# EasyEDA Pro project 2024-SS-ZT-1(最后一练).eprj

# Schematic SCH

## Sheets
1 P1: Create Date: 2024-05-29; Page Name: P1; Project Name: 2024-SS-ZT-1(最后一练); Schematic Name: SCH; Update Date: 2024-05-29; Company: EDA设计与开发; Page Size: A4; Version: V1.0
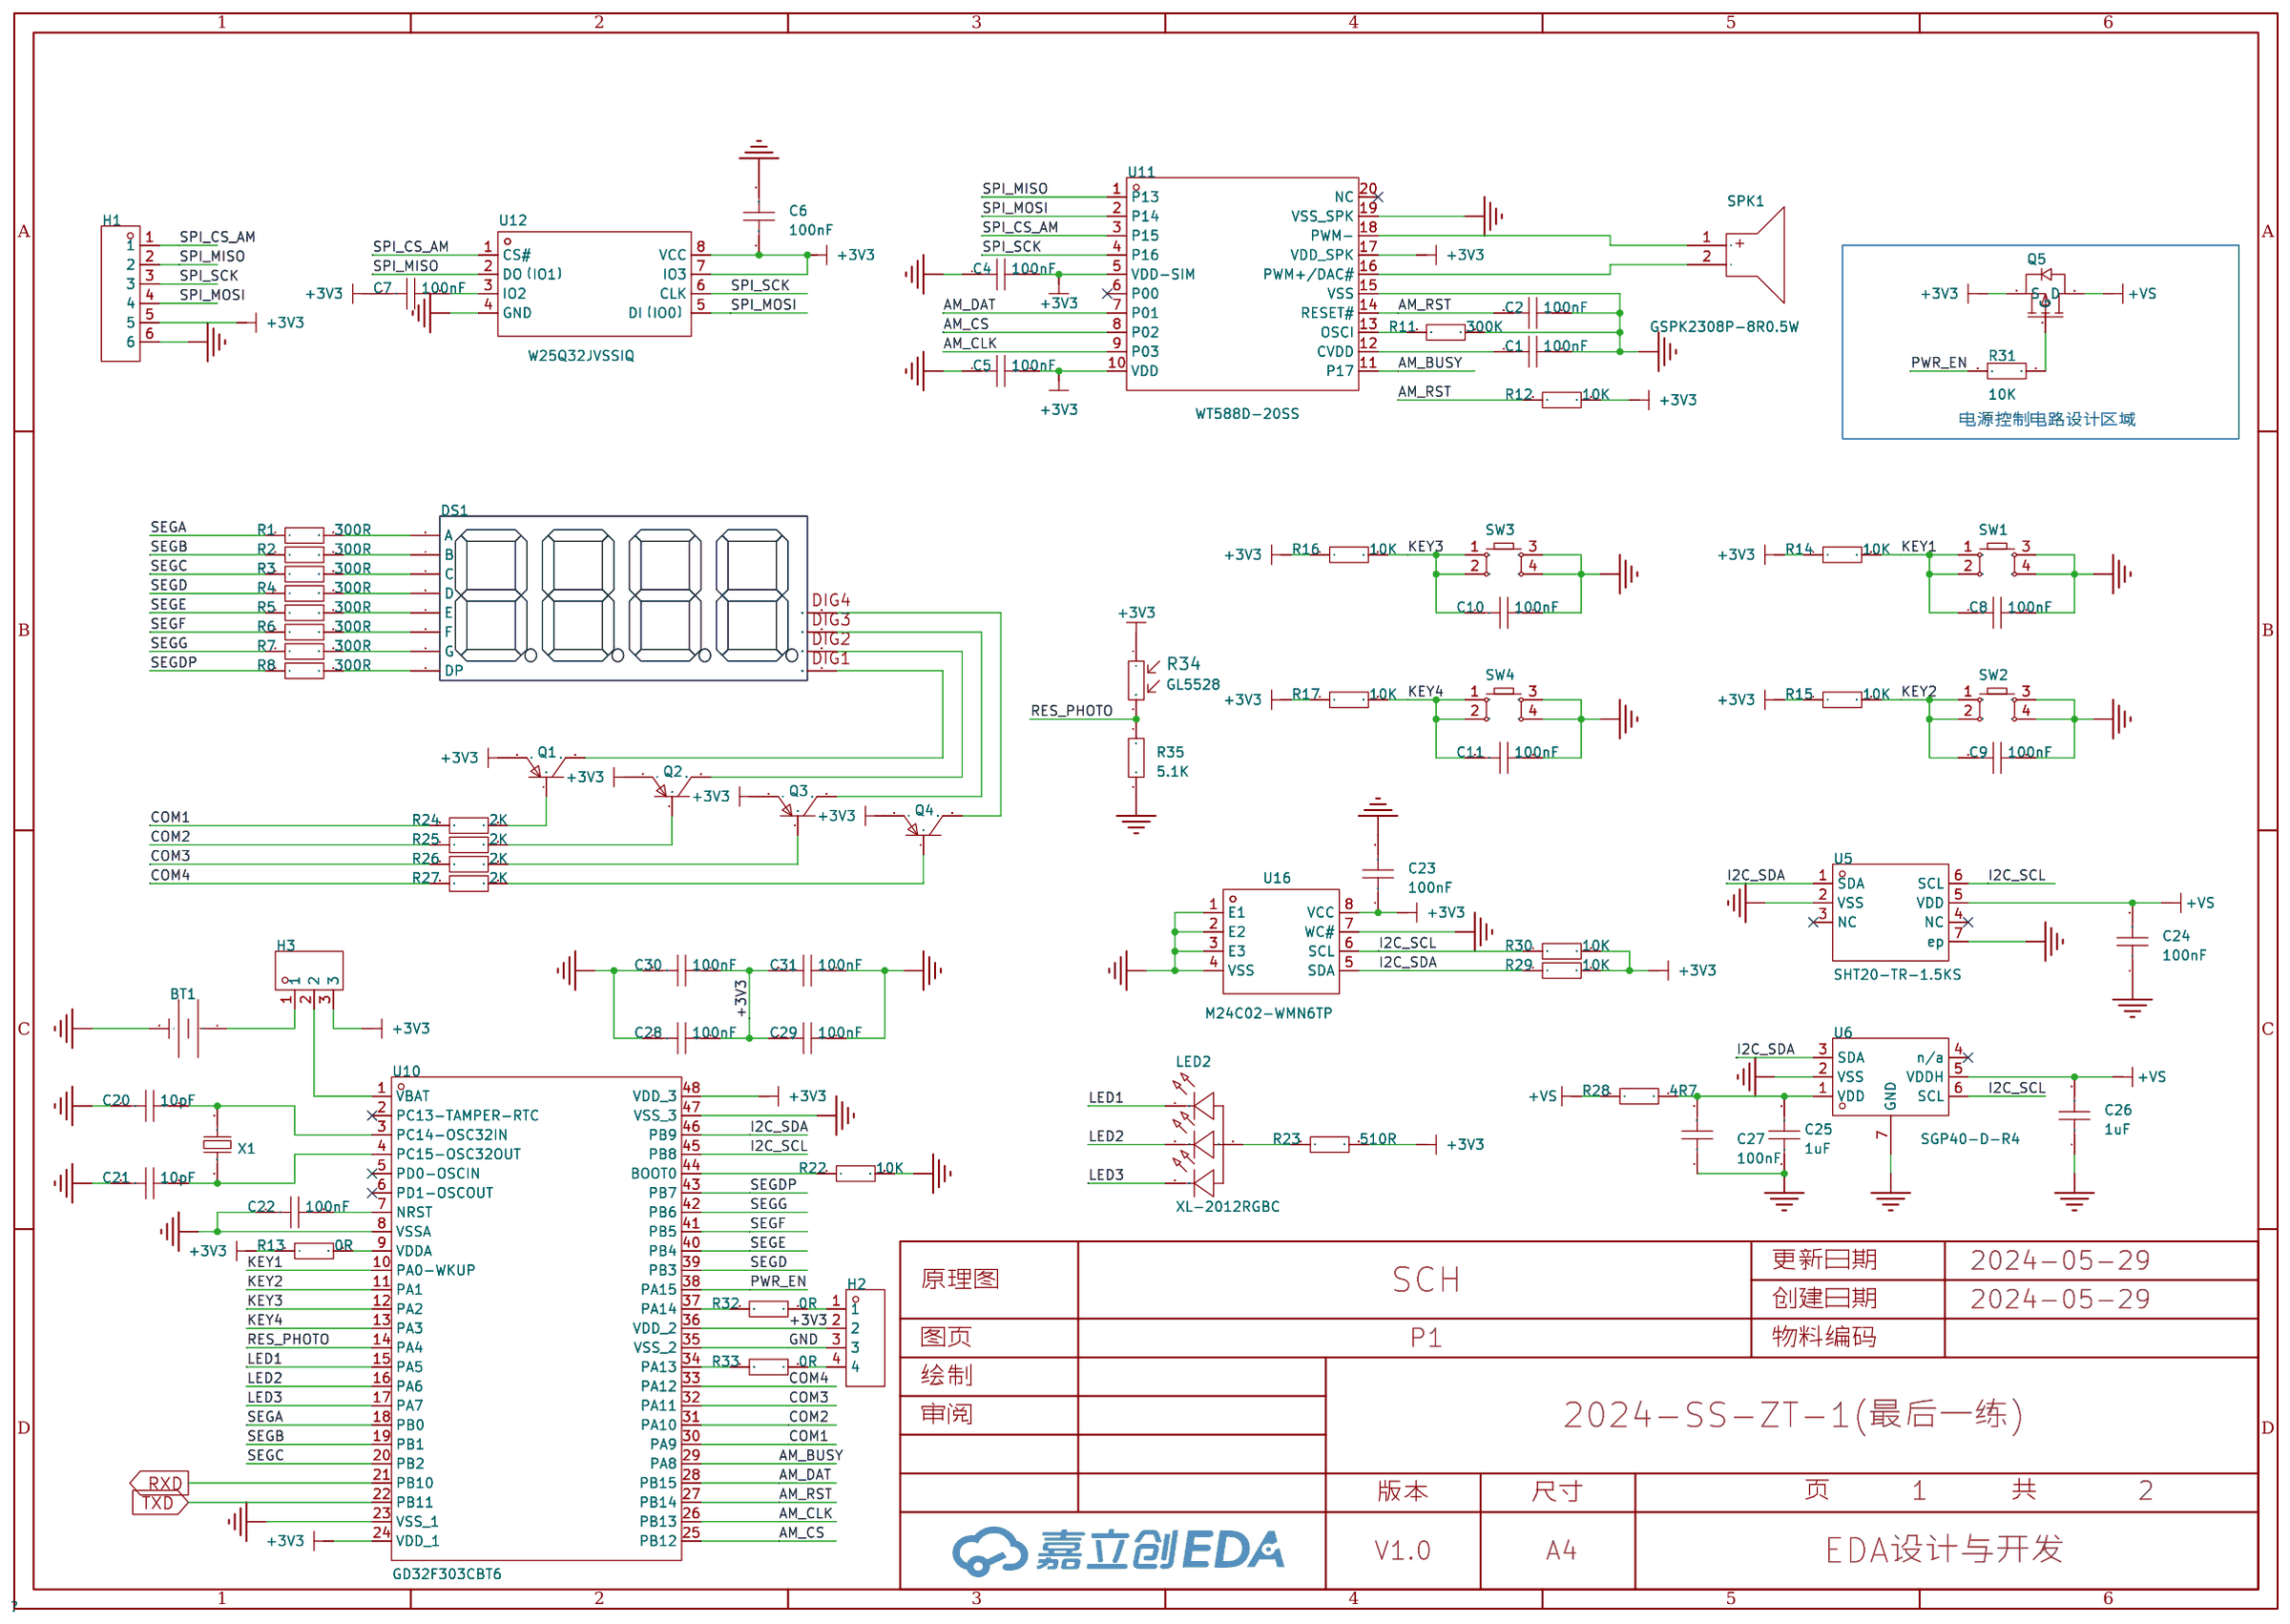
[diagram p0: P1]
2 P2: Page Name: P2; Company: 嘉立创EDA
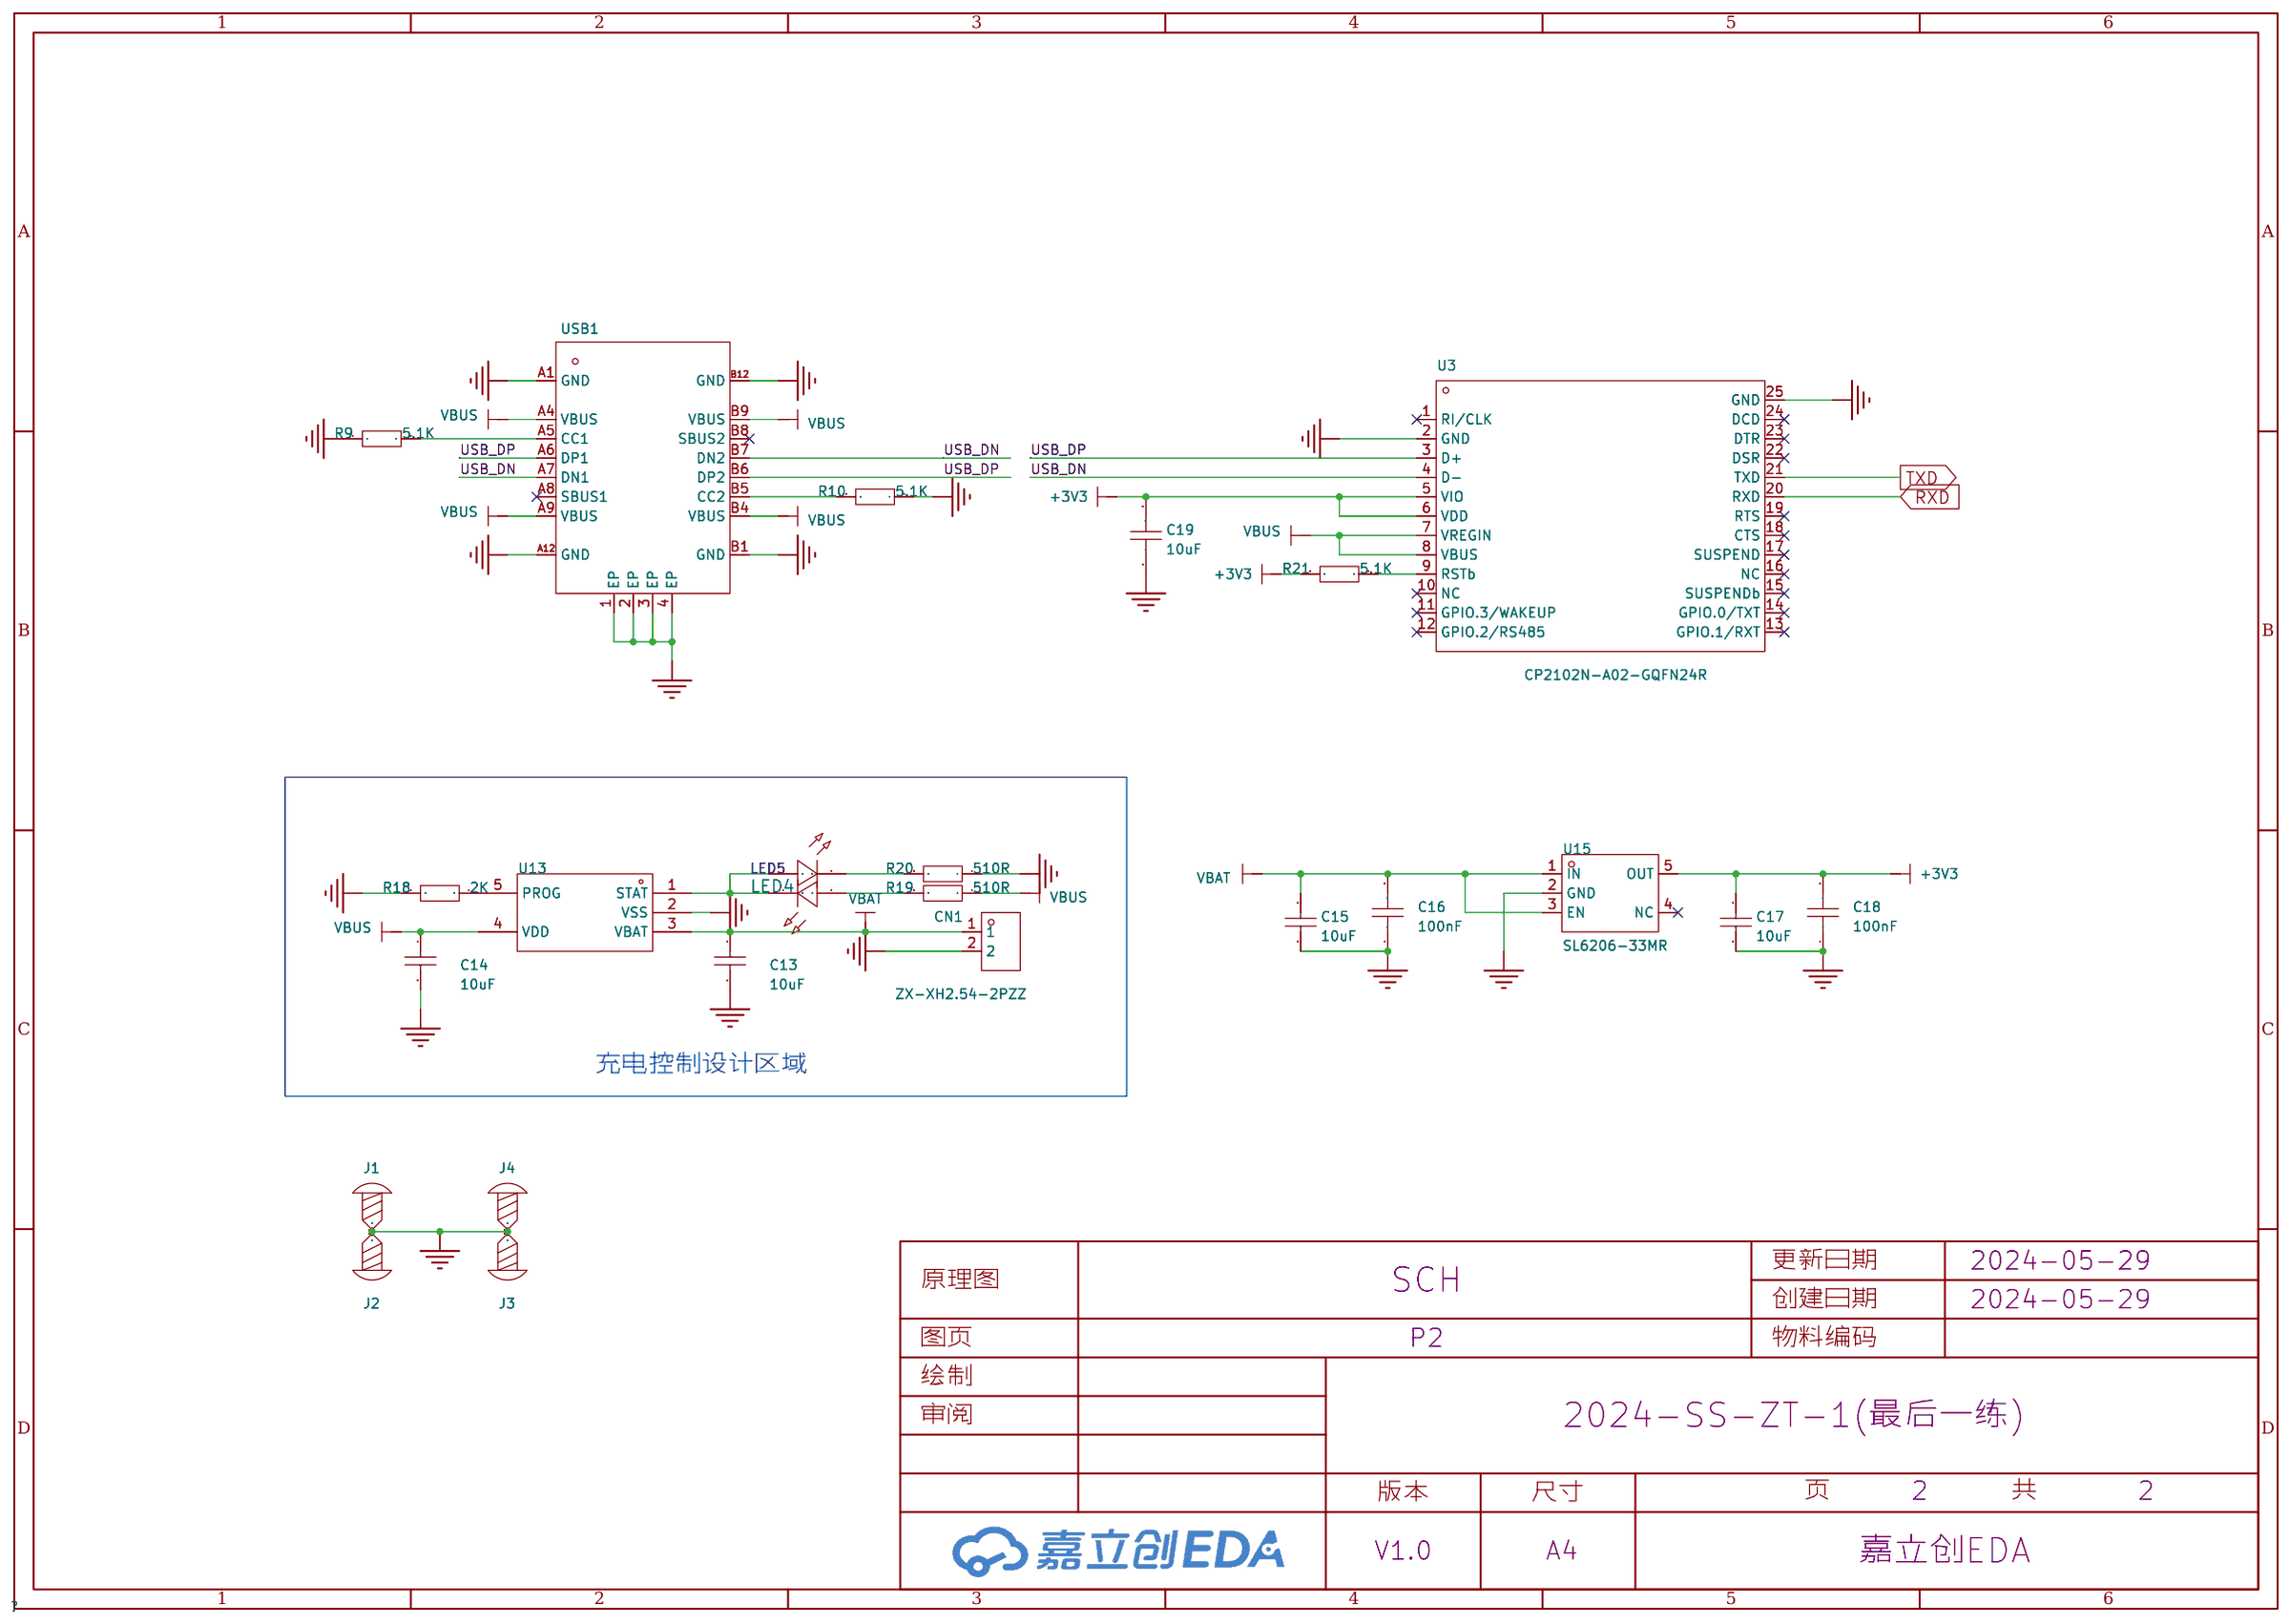
[diagram p1: P2]

## Parts
sheet P1
BT1  BS-12-B3AA003  [BAT-SMD_BS-12-B3AA011]
C1  100nF  [C0805]
C2  100nF  [C0805]
C4  100nF  [C0805]
C5  100nF  [C0805]
C6  100nF  [C0805]
C7  100nF  [C0805]
C8  100nF  [C0805]
C9  100nF  [C0805]
C10  100nF  [C0805]
C11  100nF  [C0805]
C20  10pF  [C0805]
C21  10pF  [C0805]
C22  100nF  [C0805]
C23  100nF  [C0805]
C24  100nF  [C0805]
C25  1uF  [C0805]
C26  1uF  [C0805]
C27  100nF  [C0805]
C28  100nF  [C0805]
C29  100nF  [C0805]
C30  100nF  [C0805]
C31  100nF  [C0805]
DS1  -  [LED-SEG-TH_FJ5461AH]
H1  -  [HDR-TH_6P-P2.54-V-F]
H2  -  [HDR-TH_4P-P2.54-V-F]
H3  Jumper3  [HDR-TH_3P-P2.54-V-M-A]
LED2  XL-2012RGBC  [LED-SMD_4P-L2.0-W1.3-BR]
Q1  -  [S8550P_SOT]
Q2  -  [S8550P_SOT]
Q3  -  [S8550P_SOT]
Q4  -  [S8550P_SOT]
Q5  -  [AO3401A_SOT-23-3]
R1  300R  [R0805]
R2  300R  [R0805]
R3  300R  [R0805]
R4  300R  [R0805]
R5  300R  [R0805]
R6  300R  [R0805]
R7  300R  [R0805]
R8  300R  [R0805]
R11  300K  [R0805]
R12  10K  [R0805]
R13  0R  [R0805]
R14  10K  [R0805]
R15  10K  [R0805]
R16  10K  [R0805]
R17  10K  [R0805]
R22  10K  [R0805]
R23  510R  [R0805]
R24  2K  [R0805]
R25  2K  [R0805]
R26  2K  [R0805]
R27  2K  [R0805]
R28  4R7  [R0805]
R29  10K  [R0805]
R30  10K  [R0805]
R31  10K  [R0805]
R32  0R  [R0805]
R33  0R  [R0805]
R34  GL5528  [RES-TH_L5.1-W4.3-P3.40-D0.5]
R35  5.1K  [R0805]
SPK1  GSPK2308P-8R0.5W  [SPK-TH_BD23.0-P10.00-D0.8-L-RD]
SW1  -  [Key_SMD_12x12x7.3]
SW2  -  [Key_SMD_12x12x7.3]
SW3  -  [Key_SMD_12x12x7.3]
SW4  -  [Key_SMD_12x12x7.3]
U5  SHT20-TR-1.5KS  [DFN-6_L3.0-W3.0-P0.95-TR-EP]
U6  SGP40-D-R4  [DFN-6_L2.4-W2.4-P0.80-TL-EP]
U10  GD32F303CBT6  [LQFP-48_L7.0-W7.0-P0.50-LS9.0-BL]
U11  WT588D-20SS  [SSOP-20_L7.2-W5.3-P0.65-LS7.8-BL]
U12  W25Q32JVSSIQ  [SOIC-8_L5.3-W5.3-P1.27-LS8.0-BL]
U16  M24C02-WMN6TP  [SOIC-8_L4.9-W3.9-P1.27-LS6.0-BL]
X1  32.768kHz  [FC-135R_L3.2-W1.5]
sheet P2
C13  10uF  [C1206]
C14  10uF  [C1206]
C15  10uF  [C1206]
C16  100nF  [C0805]
C17  10uF  [C1206]
C18  100nF  [C0805]
C19  10uF  [C0805]
CN1  ZX-XH2.54-2PZZ  [CONN-TH_2P-P2.50_HX25003-2A]
J1  -  [M2螺丝]
J2  -  [M2螺丝]
J3  -  [M2螺丝]
J4  -  [M2螺丝]
LED4  -  [LED_0805]
LED5  -  [LED_0805]
R9  5.1K  [R0805]
R10  5.1K  [R0805]
R18  2K  [R0805]
R19  510R  [R0805]
R20  510R  [R0805]
R21  5.1K  [R0805]
U3  CP2102N-A02-GQFN24R  [QFN-24_L4.0-W4.0-P0.50-TL-EP2.6]
U13  -  [SOP_BCON]
U15  SL6206-33MR  [SOT-23-5_L2.9-W1.6-P0.95-LS2.8-BL]
USB1  -  [USB_TYPE-C-16P]

## Library data of the parts
BT1 = BS-12-B3AA003: 连接器类型:电池底座;适用电池规格:CR1220;工作温度范围:-25℃~+85℃;; Supplier Part: C964723; Manufacturer: MYOUNG(美阳); Supplier Footprint: SMD; JLCPCB Part Class: 扩展库; Datasheet: https://atta.szlcsc.com/upload/public/pdf/source/20201218/C964723_733B638E287393F86295A2A4DAE43C75.pdf; Supplier: LCSC; Connector Type: 电池底座; Battery Type: CR1220; Operating Temperature Range: -25℃~+85℃
C1 C2 C4-C11 C16 C18-C31 = CAP_0805: Supplier Footprint: 0805
DS1 = LED_SEG_TH_0.56x4: Supplier Footprint: 插件
H1 = HDR-F_2.54_1x6P: Supplier Part: C40877; Supplier Footprint: 插件
H2 = HDR-F_2.54_1x4P: Supplier Part: C2718488; Supplier Footprint: 插件
H3 = Jumper3: Supplier Part: C2940050; Supplier Footprint: HDR-TH-3P-2.54mm; JLCPCB Part Class: 扩展库; Supplier: LCSC
LED2 = XL-2012RGBC: 发光颜色:RGB三色;功率:80mW；80mW；55mW;正向电流:25mA;主波长:619nm~624nm；463nm~466nm；524nm~527nm;二极管配置:-;透镜颜色:无色透明透镜;色温:-;发光角度:120°;载带方式:正贴;工作温度:-30℃~+85℃;; Supplier Part: C965848; Manufacturer: XINGLIGHT(成兴光); Supplier Footprint: 0805; JLCPCB Part Class: 扩展库; Datasheet: https://atta.szlcsc.com/upload/public/pdf/source/20221102/35E310354F68AE1BCFC07B93F5E395D6.pdf; Supplier: LCSC; Emitted Color: RGB三色; Power Dissipation: 80mW；80mW；55mW; Forward Current: 25mA; Dominant Wavelength: 619nm~624nm；463nm~466nm；524nm~527nm; Peak Wavelength: 624nm；528nm；469nm; Lens Color: 无色透明透镜; Viewing Angle: 120°; Mounting Sytle: 正贴; Operating Temperature: -30℃~+85℃
Q1-Q4 = S8550_SOT_PNP: Supplier Footprint: SOT-23
Q5 = AO3401A_P: Supplier Footprint: SOT-23-3L; Supplier Part: C15127
R1-R33 R35 = Res_0805: Supplier Footprint: 0805
R34 = GL5528: 暗电阻:1MΩ;亮电阻 @ 10Lux:8kΩ~20kΩ;光谱峰值(波长):540nm;; LCSC Part Name: 亮电阻:8kΩ~20kΩ 暗电阻:1MΩ; Supplier Part: C125627; Manufacturer: 森霸; Supplier Footprint: 插件,P=3mm; JLCPCB Part Class: 扩展库; Datasheet: https://atta.szlcsc.com/upload/public/pdf/source/20230427/842A99E3D53A83729D7968886D4EFCBB.pdf; Supplier: LCSC; Dark Resistance: 1MΩ; Illuminated Resistance @ 10Lux: 8kΩ~20kΩ; Applied Voltage: 150V; Spectral Peak: 540nm
SPK1 = GSPK2308P-8R0.5W: Supplier Part: C530532; Manufacturer: INGHAi(赢海); JLCPCB Part Class: 扩展库; Datasheet: https://atta.szlcsc.com/upload/public/pdf/source/20200723/C530532_3DB1F973601B36F20FBCCA52751811A3.pdf; Supplier: LCSC
SW1-SW4 = Key_SMD_12x12x7.3: Supplier Footprint: SMD
U5 = SHT20-TR-1.5KS: 接口类型:I2C;; LCSC Part Name: 1-100706-01; Supplier Part: C53865; Manufacturer: Sensirion(瑞士盛思锐); Supplier Footprint: DFN-6-EP(3x3); JLCPCB Part Class: 扩展库; Datasheet: https://atta.szlcsc.com/upload/public/pdf/source/20151012/1457707445424.pdf; Supplier: LCSC; Interface Type: I2C; Supply Voltage: 2.1V~3.6V
U6 = SGP40-D-R4: 气体类型:空气质量;精度:-;; LCSC Part Name: 3.000.384; Supplier Part: C2874215; Manufacturer: Sensirion(瑞士盛思锐); Supplier Footprint: DFN-6-EP(2.4x2.4); JLCPCB Part Class: 扩展库; Datasheet: https://atta.szlcsc.com/upload/public/pdf/source/20231011/67A6038984BE66B07B1FF2325C50691F.pdf; Supplier: LCSC; Type: 空气质量; Operating Temperature: -10℃~+50℃
U10 = GD32F303CBT6_C3013779: CPU内核:CM4;程序存储容量:128KB;RAM总容量:32KB;GPIO端口数量:37;工作电压范围:-;CPU最大主频:120MHz;程序存储器类型:FLASH;; Supplier Part: C3013779; Manufacturer: GigaDevice(兆易创新); Supplier Footprint: LQFP-48(7x7); JLCPCB Part Class: 扩展库; Datasheet: https://atta.szlcsc.com/upload/public/pdf/source/20220624/E1A57ED816B162D6D1424864911A792F.pdf; Supplier: LCSC; CPU Core: CM4; Program Storage Size: 128KB; RAM Size: 32KB; GPIO Ports Number: 37; CPU Maximum Speed: 120MHz; Program Memory Type: FLASH; ADC (Bit): 12bit; DAC (Bit): 12bit; 16Bit Timer: 7; CAN: 1; UART/USART: 3; I2C: 2; I2S: 2; SPI: 3; Peripheral/Function: 看门狗；RTC实时时钟; Watchdog: 有; Real-Time Clock: 有
U11 = WT588D-20SS: 高品质语音芯片; Supplier Part: C87498; Manufacturer: WT(唯创知音); Supplier Footprint: SSOP-20-208mil; JLCPCB Part Class: 扩展库; Datasheet: https://atta.szlcsc.com/upload/public/pdf/source/20161217/1481939141189.pdf; Supplier: LCSC
U12 = W25Q32JVSSIQ_C82344: 接口类型:SPI;存储容量:32Mbit;; Supplier Part: C82344; Manufacturer: WINBOND(华邦); Supplier Footprint: SOIC-8-208mil; JLCPCB Part Class: 扩展库; Datasheet: https://atta.szlcsc.com/upload/public/pdf/source/20160910/1473490310454.pdf; Supplier: LCSC; Interface Type: SPI; Memory Size: 32Mbit; Supply Voltage: 2.7V~3.6V; Page Programming Time (Tpp): 3ms; Operating Temperature: -40℃~+85℃
U16 = M24C02-WMN6TP: 接口类型:I2C;存储容量:2Kbit;; Supplier Part: C7562; Manufacturer: ST(意法半导体); Supplier Footprint: SOIC-8; JLCPCB Part Class: Extended Part; Datasheet: https://atta.szlcsc.com/upload/public/pdf/source/20140724/1457707167301.pdf; Supplier: LCSC; Interface Type: I2C; Memory Size: 2Kbit; Supply Voltage: 2.5V~5.5V; Operating Temperature: -40℃~+85℃
X1 = Q13FC13500004_C32346: 晶振类型:贴片晶振;频率:32.768kHz;常温频差:±20ppm;外接负载电容:12.5pF;; LCSC Part Name: 32.768kHz ±20ppm 12.5pF; Supplier Part: C32346; Manufacturer: EPSON(爱普生); Manufacturer Part: Q13FC13500004; Supplier Footprint: SMD3215-2P; JLCPCB Part Class: 基础库; Datasheet: https://atta.szlcsc.com/upload/public/pdf/source/20190108/C32346_746D6B07EAF90824457A96480007685F.pdf; Supplier: LCSC; Crystal Type: 贴片晶振; Normal temperature Frequency Tolerance: ±20ppm; External load capacitor: 12.5pF; Equivalent Series Resistance (ESR): 70kΩ; Operating Temperature: -40℃~+85℃
C13-C15 C17 = CL31A106KBHNNNE: 容值:10uF;精度:±10%;额定电压:50V;材质(温度系数):X5R;; LCSC Part Name: 10uF ±10% 50V; Supplier Part: C13585; Manufacturer: SAMSUNG(三星); Supplier Footprint: 1206; JLCPCB Part Class: 基础库; Datasheet: https://atta.szlcsc.com/upload/public/pdf/source/20160218/1457707763339.pdf; Supplier: LCSC; Tolerance: ±10%; Voltage Rated: 50V; Temperature Coefficient: X5R
CN1 = ZX-XH2.54-2PZZ: 插针结构:1x2P;间距:2.54mm;安装方式:直插;参考系列:XH;总PIN数:2P;排数:1;每排PIN数:2;行距:-;额定电流:3A;触头材质:黄铜;触头镀层:锡;工作温度范围:-25℃~+85℃;; Supplier Part: C7429632; Manufacturer: Megastar(兆星); Supplier Footprint: 插件,P=2.54mm; JLCPCB Part Class: 扩展库; Datasheet: https://atta.szlcsc.com/upload/public/pdf/source/20230619/19BA6947230AA44A04D3EDD65E618FD0.pdf; Supplier: LCSC; Pins Structure: 1x2P; Pitch: 2.54mm; Mounting Style: 直插; Reference Series: XH; Number of Pins: 2P; Number of Rows: 1; Number of PINs Per Row: 2; Current Rating (Max): 3A; Contact Material: 黄铜; Contact Plating: 锡; Operating Temperature Range: -25℃~+85℃
J1-J4 = M2螺丝: Supplier Footprint: 插件
LED4 = LED_0805-R: Supplier Footprint: 0805
LED5 = LED_0805-G: Supplier Footprint: 0805
U3 = CP2102N-A02-GQFN24R: 应用功能:USB转UART;接口协议:UART;; Supplier Part: C969151; Manufacturer: SKYWORKS/SILICON LABS(芯科); Supplier Footprint: QFN-24-EP(4x4); JLCPCB Part Class: 扩展库; Datasheet: https://atta.szlcsc.com/upload/public/pdf/source/20201204/C964632_F2B790CC23A72455AEF523510305B30A.pdf; Supplier: LCSC; Applications Function: USB转UART; Protocol: UART; Supply Voltage: 3V~3.6V; Operating Temperature: -40℃~+85℃@(Ta)
U13 = BCON
U15 = SL6206-33MR: 输出类型:-;; Supplier Part: C707122; Manufacturer: Slkor(萨科微); Supplier Footprint: SOT-23-5; JLCPCB Part Class: 扩展库; Datasheet: https://atta.szlcsc.com/upload/public/pdf/source/20200721/C707121_33633D17E61D5DC97F22208BE63A0FB1.pdf; Supplier: LCSC
USB1 = USB_TYPE-C-16P: Supplier Footprint: SMD

## Nets
+3V3: C4.2 C5.2 C6.2 C7.1 C17.2 C18.2 C19.2 C23.1 C28.1 C29.2 C30.1 C31.2 H1.5 H2.2 H3.3 Q1.2(E) Q2.2(E) Q3.2(E) Q4.2(E) Q5.2(S) R12.2 R13.1 R14.1 R15.1 R16.1 R17.1 R21.2 R23.2 R29.2 R30.2 R34.1 U3.5(VIO) U3.6(VDD) U10.24(VDD_1) U10.36(VDD_2) U10.48(VDD_3) U11.5(VDD-SIM) U11.10(VDD) U11.17(VDD_SPK) U12.7(IO3) U12.8(VCC) U15.5(OUT) U16.8(VCC)
GND: BT1.2(-) C1.2 C2.2 C4.1 C5.1 C6.1 C8.2 C9.2 C10.2 C11.2 C13.2 C14.2 C15.1 C16.1 C17.1 C18.1 C19.1 C20.1 C21.1 C22.1 C23.2 C24.1 C25.1 C26.1 C27.1 C28.2 C29.1 C30.2 C31.1 CN1.2 H1.6 H2.3 J1.1 J2.1 J3.1 J4.1 R9.1 R10.1 R11.2 R18.2 R20.1 R22.2 R35.2 SW1.3 SW1.4 SW2.3 SW2.4 SW3.3 SW3.4 SW4.3 SW4.4 U3.2(GND) U3.25(GND) U5.2(VSS) U5.7(ep) U6.2(VSS) U6.7(GND) U10.8(VSSA) U10.23(VSS_1) U10.35(VSS_2) U10.47(VSS_3) U11.15(VSS) U11.19(VSS_SPK) U12.4(GND) U13.2(VSS) U15.2(GND) U16.1(E1) U16.2(E2) U16.3(E3) U16.4(VSS) U16.7(WC#) USB1.1(EP) USB1.2(EP) USB1.3(EP) USB1.4(EP) USB1.A1(GND) USB1.A12(GND) USB1.B1(GND) USB1.B12(GND)
VBAT: C13.1 C15.2 C16.2 CN1.1 U13.3(VBAT) U15.1(IN) U15.3(EN)
VBUS: C14.1 R19.1 U3.7(VREGIN) U3.8(VBUS) U13.4(VDD) USB1.A4(VBUS) USB1.A9(VBUS) USB1.B4(VBUS) USB1.B9(VBUS)
+VS: C24.2 C26.2 Q5.3(D) R28.1 U5.5(VDD) U6.5(VDDH)
AM_BUSY: U10.29(PA8) U11.11(P17)
AM_CLK: U10.26(PB13) U11.9(P03)
AM_CS: U10.25(PB12) U11.8(P02)
AM_DAT: U10.28(PB15) U11.7(P01)
AM_RST: C2.1 R12.1 U10.27(PB14) U11.14(RESET#)
COM1: R24.1 U10.30(PA9)
COM2: R25.1 U10.31(PA10)
COM3: R26.1 U10.32(PA11)
COM4: R27.1 U10.33(PA12)
I2C_SCL: R30.1 U5.6(SCL) U6.6(SCL) U10.45(PB8) U16.6(SCL)
I2C_SDA: R29.1 U5.1(SDA) U6.3(SDA) U10.46(PB9) U16.5(SDA)
KEY1: C8.1 R14.2 SW1.1 SW1.2 U10.10(PA0-WKUP)
KEY2: C9.1 R15.2 SW2.1 SW2.2 U10.11(PA1)
KEY3: C10.1 R16.2 SW3.1 SW3.2 U10.12(PA2)
KEY4: C11.1 R17.2 SW4.1 SW4.2 U10.13(PA3)
LED1: LED2.1 U10.15(PA5)
LED2: LED2.2 U10.16(PA6)
LED3: LED2.4 U10.17(PA7)
PWR_EN: R31.2 U10.38(PA15)
RES_PHOTO: R34.2 R35.1 U10.14(PA4)
RXD: U3.20(RXD) U10.21(PB10)
SEGA: R1.1 U10.18(PB0)
SEGB: R2.1 U10.19(PB1)
SEGC: R3.1 U10.20(PB2)
SEGD: R4.1 U10.39(PB3)
SEGDP: R8.1 U10.43(PB7)
SEGE: R5.1 U10.40(PB4)
SEGF: R6.1 U10.41(PB5)
SEGG: R7.1 U10.42(PB6)
SPI_CS_AM: H1.1 U11.3(P15) U12.1(CS#)
SPI_MISO: H1.2 U11.1(P13) U12.2(DO（IO1）)
SPI_MOSI: H1.4 U11.2(P14) U12.5(DI（IO0）)
SPI_SCK: H1.3 U11.4(P16) U12.6(CLK)
TXD: U3.21(TXD) U10.22(PB11)
USB_DN: U3.4(D-) USB1.A7(DN1) USB1.B7(DN2)
USB_DP: U3.3(D+) USB1.A6(DP1) USB1.B6(DP2)
$1N1449: DS1.8(DIG3) Q3.3(C)
$1N1467: DS1.1(E) R5.2
$1N1471: DS1.2(D) R4.2
$1N1475: DS1.3(DP) R8.2
$1N1479: DS1.4(C) R3.2
$1N1483: DS1.5(G) R7.2
$1N1487: DS1.11(A) R1.2
$1N1491: DS1.7(B) R2.2
$1N1495: DS1.10(F) R6.2
$1N6161: C1.1 U11.12(CVDD)
$1N6192: R11.1 U11.13(OSCI)
$1N6375: SPK1.1(+) U11.18(PWM-)
$1N6384: SPK1.2(-) U11.16(PWM+/DAC#)
$1N6917: C7.2 U12.3(IO2)
$1N7212: R13.2 U10.9(VDDA)
$1N7925: C20.2 U10.3(PC14-OSC32IN) X1.1
$1N7930: C21.2 U10.4(PC15-OSC32OUT) X1.2
$1N8028: R22.1 U10.44(BOOT0)
$1N8104: LED2.3 R23.1
$1N8256: DS1.12(DIG1) Q1.3(C)
$1N8335: DS1.9(DIG2) Q2.3(C)
$1N8343: DS1.6(DIG4) Q4.3(C)
$1N8477: Q1.1(B) R24.2
$1N8481: Q2.1(B) R25.2
$1N8485: Q3.1(B) R26.2
$1N8489: Q4.1(B) R27.2
$1N8598: C22.2 U10.7(NRST)
$1N9384: C25.2 C27.2 R28.2 U6.1(VDD)
$1N9794: R32.1 U10.37(PA14)
$1N9795: H2.1 R32.2
$1N9824: R33.1 U10.34(PA13)
$1N9825: H2.4 R33.2
$1N10132: BT1.1(+) H3.1
$1N10135: H3.2 U10.1(VBAT)
$1N18652: Q5.1(G) R31.1
$2N394: R9.2 USB1.A5(CC1)
$2N397: R10.2 USB1.B5(CC2)
$2N1836: R21.1 U3.9(RSTb)
$2N6842: R18.1 U13.5(PROG)
$2N6856: LED4.1(C) LED5.2(A) U13.1(STAT)
$2N6873: LED4.2(A) R19.2
$2N6876: LED5.1(C) R20.2

Not connected (* = marked no-connect by the designer): U3 1(RI/CLK)* 10(NC)* 11(GPIO.3/WAKEUP)* 12(GPIO.2/RS485)* 13(GPIO.1/RXT)* 14(GPIO.0/TXT)* 15(SUSPENDb)* 16(NC)* 17(SUSPEND)* 18(CTS)* 19(RTS)* 22(DSR)* 23(DTR)* 24(DCD)*; U5 3(NC)* 4(NC)*; U6 4(n/a)*; U10 2(PC13-TAMPER-RTC)* 5(PD0-OSCIN)* 6(PD1-OSCOUT)*; U11 6(P00)* 20(NC)*; U15 4(NC)*; USB1 A8(SBUS1)* B8(SBUS2)*

## Notes on the sheets
sheet 1
- 电源控制电路设计区域
sheet 2
- 充电控制设计区域

# Board PCB3
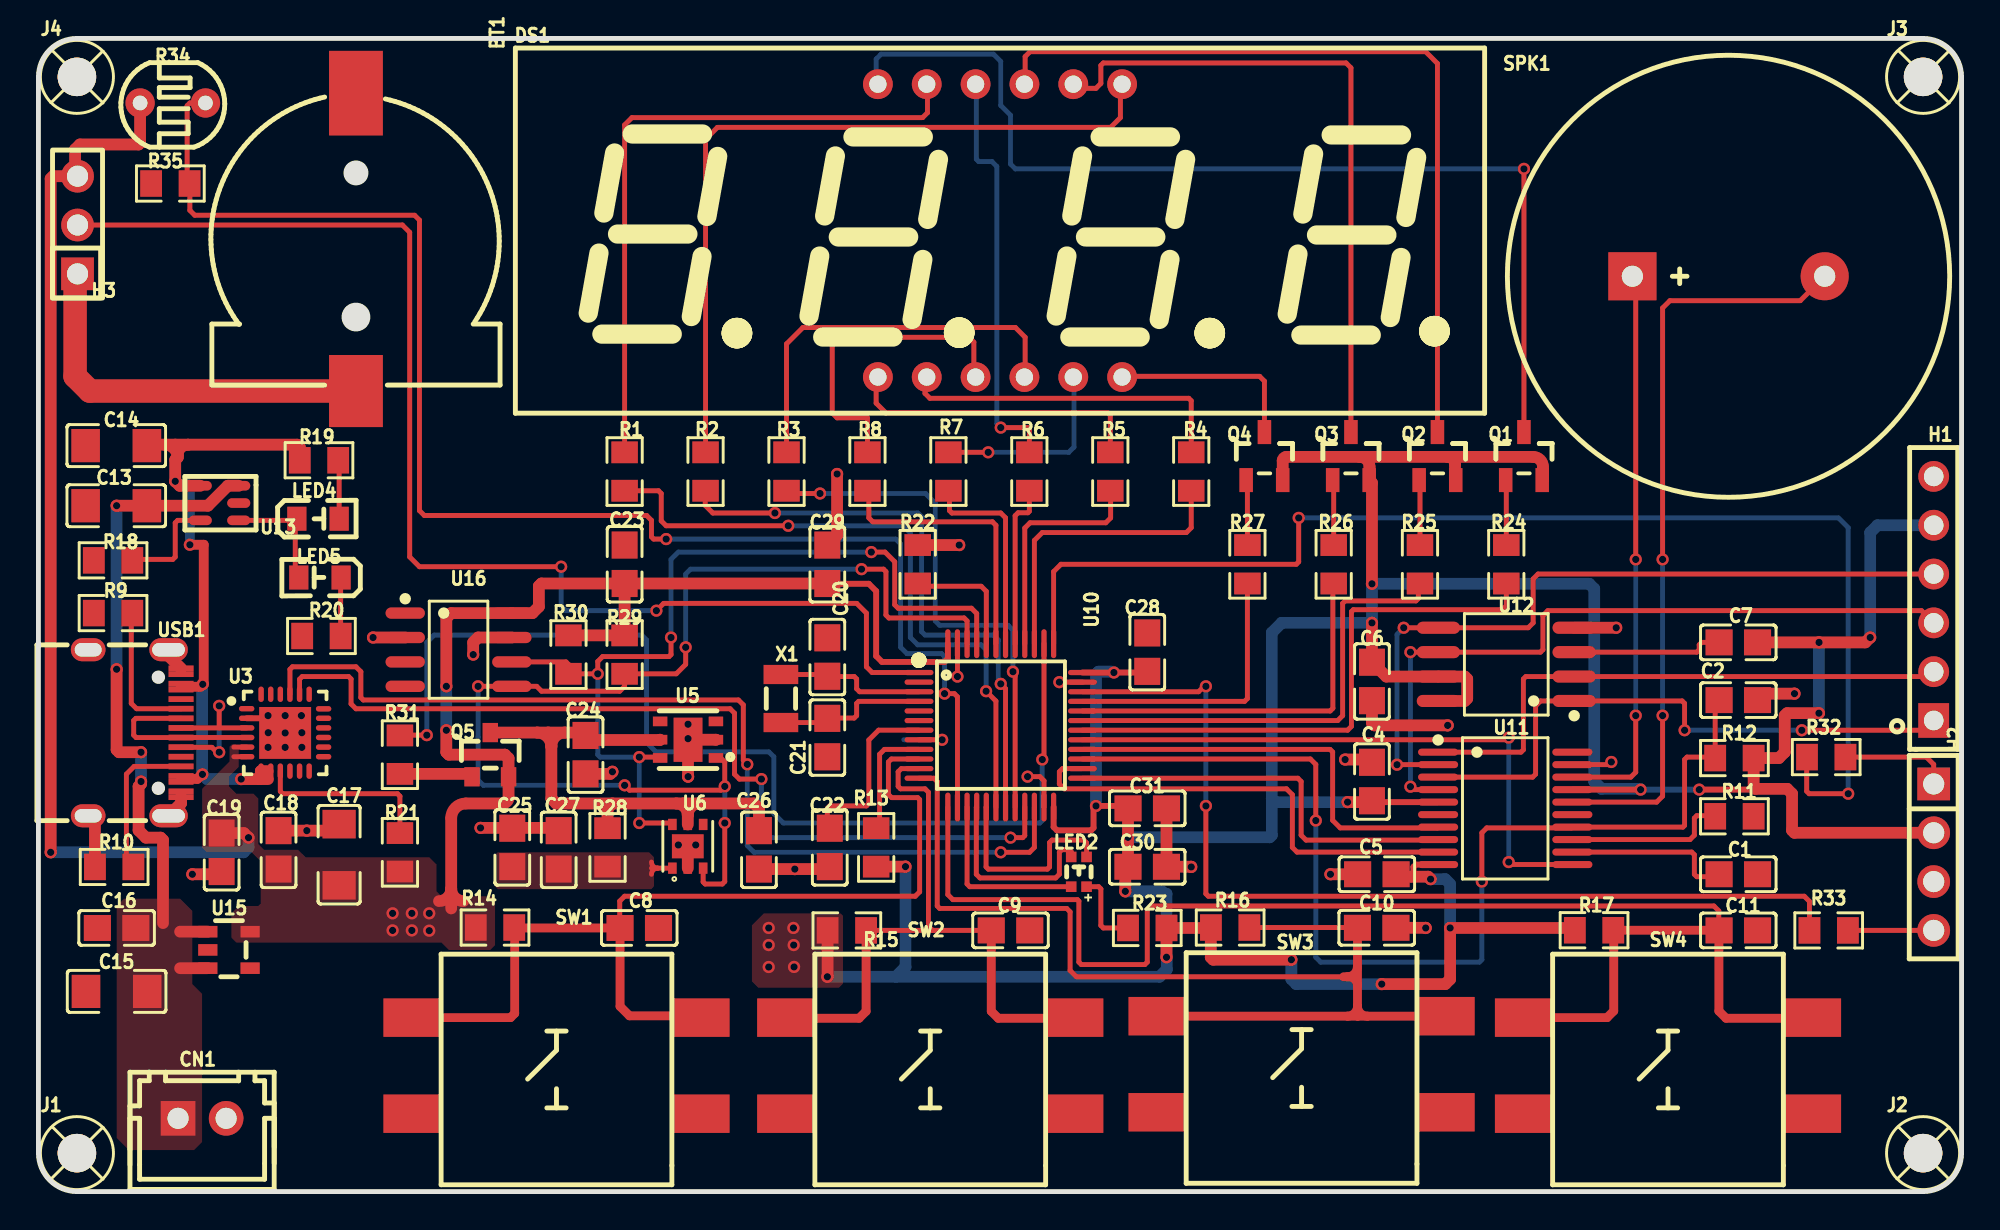
[diagram p2: board, top side]
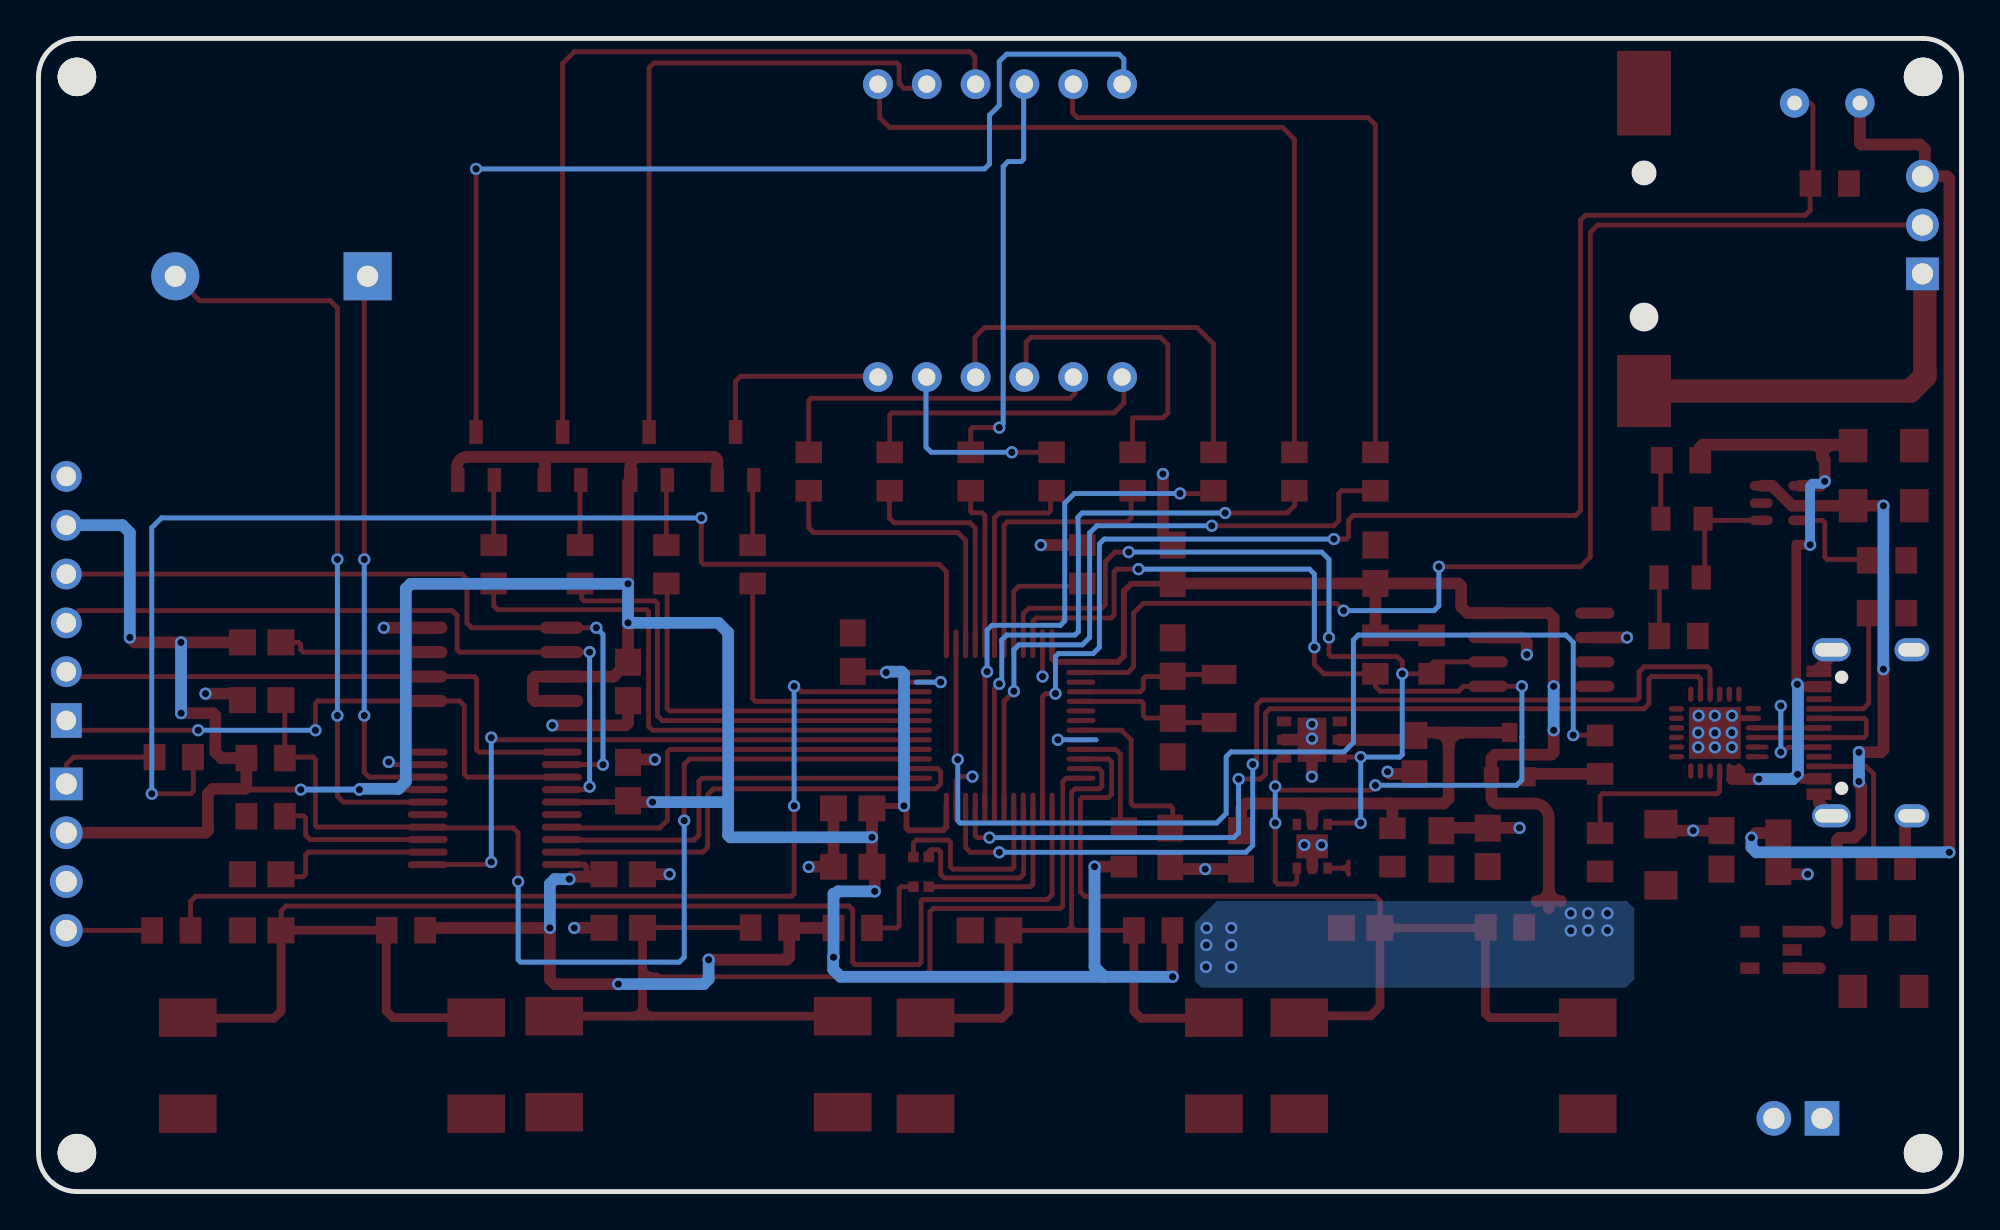
[diagram p3: board, bottom side, seen from below]

Outline 100 x 60 mm; copper layers: Top Layer, Bottom Layer. Coordinates in mm from the lower left corner of the outline.
Outline path: 0,58 0,2 arc(0.59,0.59) 2,0 98,0 arc(99.41,0.59) 100,2 100,58 arc(99.41,59.41) 98,60 2,60 arc(0.59,59.41) 0,58
Stack: Top Layer 0.035mm / Dielectric1 1.51mm FR4 er 4.5 / Bottom Layer 0.035mm

## Design rules (mm)
net USB_DP: DP1
net USB_DN: DP1
template: 自定义配置
spacing copperThickness1oz (default): track to track 0.203, other pairs 0.178 to 0.203
spacing copperThickness2oz: track to track 0.203, other pairs 0.152 to 0.3
track width copperThickness1oz (default): min 0.254, default 0.254, max 2.54
track width copperThickness2oz: min 0.203, default 0.254, max 2.54
track width PWR: min 0.254, default 0.61, max 2.54
differential pair differentialPair (default): width min 0.127, default 0.254, max 2.54; gap min 0.152, default 0.152
via viaSize (default): diameter min 0.635, default 0.635, max 10; hole min 0.381, default 0.381, max 6.299
net GND uses PWR
net +3V3 uses PWR
net +VS uses PWR
net VBUS uses PWR
net VBAT uses PWR

## Placement (name value [footprint] x y rotation side)
BT1  BS-12-B3AA003  [BAT-SMD_BS-12-B3AA011]  16.51 49.4 270 top
C1  100nF  [C0805]  88.39 16.51 0 top
C2  100nF  [C0805]  88.39 25.57 0 top
C4  100nF  [C0805]  69.34 21.34 270 top
C5  100nF  [C0805]  69.6 16.51 0 top
C6  100nF  [C0805]  69.34 26.54 90 top
C7  100nF  [C0805]  88.39 28.58 180 top
C8  100nF  [C0805]  31.24 13.72 0 top
C9  100nF  [C0805]  50.55 13.59 0 top
C10  100nF  [C0805]  69.59 13.72 0 top
C11  100nF  [C0805]  88.39 13.59 0 top
C13  10uF  [C1206]  4.05 35.69 180 top
C14  10uF  [C1206]  4.05 38.81 180 top
C15  10uF  [C1206]  4.06 10.41 0 top
C16  100nF  [C0805]  4.06 13.72 0 top
C17  10uF  [C1206]  15.63 17.53 270 top
C18  100nF  [C0805]  12.48 17.78 270 top
C19  10uF  [C0805]  9.53 17.65 90 top
C20  10pF  [C0805]  41.02 27.81 270 top
C21  10pF  [C0805]  41.02 23.62 90 top
C22  100nF  [C0805]  41.15 17.91 90 top
C23  100nF  [C0805]  30.48 32.64 90 top
C24  100nF  [C0805]  28.45 22.73 90 top
C25  1uF  [C0805]  24.64 17.91 270 top
C26  1uF  [C0805]  37.47 17.78 90 top
C27  100nF  [C0805]  27.05 17.78 270 top
C28  100nF  [C0805]  57.66 28.07 90 top
C29  100nF  [C0805]  41.02 32.64 270 top
C30  100nF  [C0805]  57.66 16.9 0 top
C31  100nF  [C0805]  57.66 19.94 180 top
CN1  ZX-XH2.54-2PZZ  [CONN-TH_2P-P2.50_HX25003-2A]  8.51 3.81 0 top
DS1  -  [LED-SEG-TH_FJ5461AH]  50 50 0 top
H1  -  [HDR-TH_6P-P2.54-V-F]  98.55 30.86 90 top
H2  -  [HDR-TH_4P-P2.54-V-F]  98.55 17.4 270 top
H3  Jumper3  [HDR-TH_3P-P2.54-V-M-A]  2.03 50.29 90 top
J1  -  [M2螺丝]  2 2 0 top
J2  -  [M2螺丝]  98 2 0 top
J3  -  [M2螺丝]  98 58 0 top
J4  -  [M2螺丝]  2 58 0 top
LED2  XL-2012RGBC  [LED-SMD_4P-L2.0-W1.3-BR]  54.1 16.64 270 top
LED4  -  [LED_0805]  14.59 35 0 top
LED5  -  [LED_0805]  14.59 31.96 180 top
Q1  -  [S8550P_SOT]  77.25 38.31 270 top
Q2  -  [S8550P_SOT]  72.75 38.31 270 top
Q3  -  [S8550P_SOT]  68.25 38.31 270 top
Q4  -  [S8550P_SOT]  63.75 38.31 270 top
Q5  -  [AO3401A_SOT-23-3]  23.5 22.73 270 top
R1  300R  [R0805]  30.48 37.47 90 top
R2  300R  [R0805]  34.69 37.47 90 top
R3  300R  [R0805]  38.9 37.47 90 top
R4  300R  [R0805]  59.94 37.47 90 top
R5  300R  [R0805]  55.74 37.47 90 top
R6  300R  [R0805]  51.53 37.47 90 top
R7  300R  [R0805]  47.32 37.47 90 top
R8  300R  [R0805]  43.11 37.47 90 top
R9  5.1K  [R0805]  3.88 30.1 0 top
R10  5.1K  [R0805]  3.94 16.89 0 top
R11  300K  [R0805]  88.19 19.53 0 top
R12  10K  [R0805]  88.19 22.56 0 top
R13  0R  [R0805]  43.56 17.91 90 top
R14  10K  [R0805]  23.74 13.74 0 top
R15  10K  [R0805]  42.04 13.59 0 top
R16  10K  [R0805]  61.97 13.74 0 top
R17  10K  [R0805]  80.89 13.6 0 top
R18  2K  [R0805]  3.88 32.84 180 top
R19  510R  [R0805]  14.59 38.05 0 top
R20  510R  [R0805]  14.71 28.91 0 top
R21  5.1K  [R0805]  18.8 17.65 270 top
R22  10K  [R0805]  45.72 32.64 90 top
R23  510R  [R0805]  57.66 13.72 0 top
R24  2K  [R0805]  76.33 32.64 90 top
R25  2K  [R0805]  71.84 32.64 90 top
R26  2K  [R0805]  67.35 32.64 90 top
R27  2K  [R0805]  62.87 32.64 90 top
R28  4R7  [R0805]  29.59 17.91 270 top
R29  10K  [R0805]  30.48 27.94 90 top
R30  10K  [R0805]  27.56 27.94 90 top
R31  10K  [R0805]  18.8 22.73 90 top
R32  0R  [R0805]  92.96 22.61 0 top
R33  0R  [R0805]  93.09 13.59 0 top
R34  GL5528  [RES-TH_L5.1-W4.3-P3.40-D0.5]  6.98 56.64 90 top
R35  5.1K  [R0805]  6.86 52.45 180 top
SPK1  GSPK2308P-8R0.5W  [SPK-TH_BD23.0-P10.00-D0.8-L-RD]  87.88 47.62 0 top
SW1  -  [Key_SMD_12x12x7.3]  26.94 6.55 180 top
SW2  -  [Key_SMD_12x12x7.3]  46.37 6.55 180 top
SW3  -  [Key_SMD_12x12x7.3]  65.68 6.63 180 top
SW4  -  [Key_SMD_12x12x7.3]  84.74 6.55 180 top
U3  CP2102N-A02-GQFN24R  [QFN-24_L4.0-W4.0-P0.50-TL-EP2.6]  12.83 23.88 0 top
U5  SHT20-TR-1.5KS  [DFN-6_L3.0-W3.0-P0.95-TR-EP]  33.78 23.51 270 top
U6  SGP40-D-R4  [DFN-6_L2.4-W2.4-P0.80-TL-EP]  33.76 17.96 90 top
U10  GD32F303CBT6  [LQFP-48_L7.0-W7.0-P0.50-LS9.0-BL]  50.04 24.26 270 top
U11  WT588D-20SS  [SSOP-20_L7.2-W5.3-P0.65-LS7.8-BL]  76.27 19.94 270 top
U12  W25Q32JVSSIQ  [SOIC-8_L5.3-W5.3-P1.27-LS8.0-BL]  76.33 27.43 90 top
U13  -  [SOP_BCON]  10.41 34.92 180 top
U15  SL6206-33MR  [SOT-23-5_L2.9-W1.6-P0.95-LS2.8-BL]  9.91 12.57 270 top
U16  M24C02-WMN6TP  [SOIC-8_L4.9-W3.9-P1.27-LS6.0-BL]  21.84 28.19 270 top
USB1  -  [USB_TYPE-C-16P]  5 24 270 top
X1  32.768kHz  [FC-135R_L3.2-W1.5]  38.61 25.65 270 top

## Footprints (pads in the part's own frame, mm; a bottom-side part is the same pattern mirrored in y, then rotated)
AO3401A_SOT-23-3
  rect 1x0.8 smd: 1(1.15,-0.95) 2(1.15,0.95) 3(-1.15,0)
BAT-SMD_BS-12-B3AA011
  rect 3.75x2.8 smd: 1(7.75,0)
  rect 4.4x2.8 smd: 2(-7.75,0)
C0805
  rect 1.41x1.35 smd: 1(-1,0) 2(1,0)
C1206
  rect 1.485x1.728 smd: 1(-1.593,0) 2(1.593,0)
CONN-TH_2P-P2.50_HX25003-2A
  rect 1.8x1.8 hole 1.1: 1(-1.25,0)
  round 1.8 hole 1.1: 2(1.25,0)
DFN-6_L2.4-W2.4-P0.80-TL-EP
  rect 0.585x0.448 smd: 1(-1.137,0.8) 2(-1.137,0) 3(-1.137,-0.8) 4(1.137,-0.8) 5(1.137,0) 6(1.137,0.8)
  rect 1.25x1.65 smd: 7(0,0)
DFN-6_L3.0-W3.0-P0.95-TR-EP
  rect 0.5x0.75 smd: 1(0.95,1.452) 2(0,1.451) 3(-0.95,1.45) 4(-0.95,-1.452) 5(0,-1.452) 6(0.95,-1.451)
  rect 2.3x1.5 smd: 7(0.004,-0.001)
FC-135R_L3.2-W1.5
  rect 1x1.8 smd: 1(-1.25,0) 2(1.25,0)
HDR-TH_3P-P2.54-V-M-A
  rect 1.7x1.7 hole 1.1: 1(-2.54,0)
  round 1.7 hole 1.1: 2(0,0) 3(2.54,0)
HDR-TH_4P-P2.54-V-F
  rect 1.7x1.7 hole 1.1: 1(-3.81,0)
  round 1.7 hole 1.1: 2(-1.27,0) 3(1.27,0) 4(3.81,0)
HDR-TH_6P-P2.54-V-F
  rect 1.8x1.6 hole 1.02: 1(-6.35,0)
  round 1.6 hole 1.02: 2(-3.81,0) 3(-1.27,0) 4(1.27,0) 5(3.81,0) 6(6.35,0)
Key_SMD_12x12x7.3
  rect 2.999x1.999 smd: 1(-7.5,-2.499) 2(7.5,-2.499) 3(7.5,2.499) 4(-7.5,2.499)
LED-SEG-TH_FJ5461AH
  round 1.55 hole 0.9: 1(-6.35,-7.62) 2(-3.81,-7.62) 3(-1.27,-7.62) 4(1.27,-7.62) 5(3.81,-7.62) 6(6.35,-7.62) 7(6.35,7.62) 8(3.81,7.62) 9(1.27,7.62) 10(-1.27,7.62) 11(-3.81,7.62) 12(-6.35,7.62)
LED-SMD_4P-L2.0-W1.3-BR
  rect 0.55x0.55 smd: 1(0.775,-0.4) 2(-0.775,-0.4) 3(0.775,0.4) 4(-0.775,0.4)
LED_0805
  rect 1x1.25 smd: 1(-1.15,0.005) 2(1.05,0.005)
LQFP-48_L7.0-W7.0-P0.50-LS9.0-BL
  oval 0.27x1.5 smd: 1(-2.75,-4.25) 2(-2.25,-4.25) 3(-1.75,-4.25) 4(-1.25,-4.25) 5(-0.75,-4.25) 6(-0.25,-4.25) 7(0.25,-4.25) 8(0.75,-4.25) 9(1.25,-4.25) 10(1.75,-4.25) 11(2.25,-4.25) 12(2.75,-4.25) 25(2.75,4.25) 26(2.25,4.25) 27(1.75,4.25) 28(1.25,4.25) 29(0.75,4.25) 30(0.25,4.25) 31(-0.25,4.25) 32(-0.75,4.25) 33(-1.25,4.25) 34(-1.75,4.25) 35(-2.25,4.25) 36(-2.75,4.25)
  oval 1.5x0.27 smd: 13(4.25,-2.75) 14(4.25,-2.25) 15(4.25,-1.75) 16(4.25,-1.25) 17(4.25,-0.75) 18(4.25,-0.25) 19(4.25,0.25) 20(4.25,0.75) 21(4.25,1.25) 22(4.25,1.75) 23(4.25,2.25) 24(4.25,2.75) 37(-4.25,2.75) 38(-4.25,2.25) 39(-4.25,1.75) 40(-4.25,1.25) 41(-4.25,0.75) 42(-4.25,0.25) 43(-4.25,-0.25) 44(-4.25,-0.75) 45(-4.25,-1.25) 46(-4.25,-1.75) 47(-4.25,-2.25) 48(-4.25,-2.75)
M2螺丝
  round 2 hole 2: 1(0,0)
QFN-24_L4.0-W4.0-P0.50-TL-EP2.6
  oval 0.8x0.28 smd: 1(-2,1.25) 2(-2,0.75) 3(-2,0.25) 4(-2,-0.25) 5(-2,-0.75) 6(-2,-1.25) 13(2,-1.25) 14(2,-0.75) 15(2,-0.25) 16(2,0.25) 17(2,0.75) 18(2,1.242)
  oval 0.28x0.8 smd: 7(-1.25,-2) 8(-0.75,-2) 9(-0.25,-2) 10(0.25,-2) 11(0.75,-2) 12(1.25,-2) 19(1.25,2) 20(0.75,2) 21(0.25,2) 22(-0.25,2) 23(-0.75,2) 24(-1.25,2)
  rect 2.7x2.7 smd: 25(0,-0.013)
R0805
  rect 1.133x1.377 smd: 1(-1,0) 2(1,0)
RES-TH_L5.1-W4.3-P3.40-D0.5
  round 1.524 hole 0.762: 1(0,1.7) 2(0,-1.7)
S8550P_SOT
  rect 1.25x0.701 smd: 1(1.292,-0.95) 2(1.292,0.95) 3(-1.208,0)
SOIC-8_L4.9-W3.9-P1.27-LS6.0-BL
  oval 0.588x2.045 smd: 1(-1.905,-2.772) 2(-0.635,-2.772) 3(0.635,-2.772) 4(1.905,-2.772) 5(1.905,2.772) 6(0.635,2.772) 7(-0.635,2.772) 8(-1.905,2.772)
SOIC-8_L5.3-W5.3-P1.27-LS8.0-BL
  oval 0.63x2.25 smd: 1(-1.905,-3.53) 2(-0.635,-3.53) 3(0.635,-3.53) 4(1.905,-3.53) 5(1.905,3.53) 6(0.635,3.53) 7(-0.635,3.53) 8(-1.905,3.53)
SOP_BCON
  oval 1.2x0.5 smd: 1(0,0) 2(0,-0.9) 3(0,-1.8) 4(2,-1.8) 5(2,0)
SOT-23-5_L2.9-W1.6-P0.95-LS2.8-BL
  rect 0.6x1 smd: 1(-0.95,-1.1) 2(0,-1.1) 3(0.95,-1.1) 4(0.95,1.1) 5(-0.95,1.1)
SPK-TH_BD23.0-P10.00-D0.8-L-RD
  rect 2.5x2.5 hole 1.1: 1(-5,0)
  round 2.5 hole 1.1: 2(5,0)
SSOP-20_L7.2-W5.3-P0.65-LS7.8-BL
  oval 0.364x2.082 smd: 1(-2.925,-3.491) 2(-2.275,-3.491) 3(-1.625,-3.491) 4(-0.975,-3.491) 5(-0.325,-3.491) 6(0.325,-3.491) 7(0.975,-3.491) 8(1.625,-3.491) 9(2.275,-3.491) 10(2.925,-3.491) 11(2.925,3.491) 12(2.275,3.491) 13(1.625,3.491) 14(0.975,3.491) 15(0.325,3.491) 16(-0.325,3.491) 17(-0.975,3.491) 18(-1.625,3.491) 19(-2.275,3.491) 20(-2.925,3.491)
USB_TYPE-C-16P
  oval 1.2x2 hole 0.7x1.7: 1(-4.193,1.765) 2(4.447,1.765)
  oval 1.2x1.8 hole 0.7x1.4: 3(-4.193,-2.415) 4(4.447,-2.415)
  rect 0.3x1.3 smd: A1(-3.223,2.415) A4(-2.423,2.415) A5(-1.123,2.415) A6(-0.123,2.415) A7(0.377,2.415) A8(1.377,2.415) A9(2.677,2.415) A12(3.477,2.415) B1(3.177,2.415) B4(2.377,2.415) B5(1.877,2.415) B6(0.877,2.415) B7(-0.623,2.415) B8(-1.623,2.415) B9(-2.123,2.415) B12(-2.923,2.415)

## Nets
As in the schematic.

Pads without a net: U3 1 10 11 12 13 14 15 16 17 18 19 22 23 24; U5 3 4; U6 4; U10 2 5 6; U11 6 20; U15 4; USB1 A8 B8

## Via types
v1: diameter 0.635, hole 0.381, Top Layer to Bottom Layer, 129 vias

## Routing (per net, layer and track width the routed paths; a pad name or vN(x,y) marks a point on that pad's centre or on a via; arc(x,y) is an arc through that point)
+3V3: length 347.5
  Top Layer w0.254: 10.81,22.63 10.16,22.63 ; 10.81,23.13 10.16,23.13
  Top Layer w0.305: U10.48 47.29,27.73 47.12,27.56 43.87,27.56 43.56,27.86 43.56,31.24 43.18,31.62 41.04,31.62 C29.2 ; U11.10 71.62,17.01 71.5,16.89 71.5,16.51 71.37,16.38 ; 89.19,21.05 89.06,20.91 v1(86.36,20.91) ; U10.24 52.79,18.97 52.96,18.8 54.74,18.8 54.86,18.92 54.86,19.94 v1(54.99,20.07) 56.66,20.07 ; C4.2 69.41,20.26 U11.5 ; C28.1 57.6,27.01 v1(55.92,27.01) U10.36 ; U11.17 v1(83.31,20.91)
  Top Layer w0.61: 70.6,16.38 72.26,16.38 v1(72.39,16.26) ; 60.96,13.73 60.96,12.19 61.09,12.06 v1(65.15,12.06) ; 60.96,13.73 60.95,13.72 R23.2 v1(58.66,12.19) ; 60.96,13.73 R16.1 ; R17.1 79.77,13.72 v1(73.41,13.72) 73.41,11.05 73.15,10.79 v1(69.85,10.79) ; C23.1 R29.2 R30.2 ; C23.1 C29.2 ; C23.1 26.16,31.64 26.02,31.5 26.02,30.43 25.69,30.1 U16.8 21.46,30.1 21.21,29.84 v1(21.21,26.29) ; C7.1 v1(92.59,28.58) 95,28.58 v1(95.25,28.83) ; v1(56.51,15.62) 56.51,16.76 C30.1 v1(56.66,18.43) 56.66,20.06 56.66,20.07 ; 21.46,15.75 21.46,14.73 ; 21.46,15.75 21.46,19.43 arc(21.69,19.97) 22.22,20.19 24.13,20.19 arc(24.35,20.29) 24.44,20.51 24.44,22.55 24.26,22.73 21.34,22.73 21.21,22.86 v1(21.21,24) ; 21.46,15.75 arc(21.65,15.3) 22.1,15.11 ; 21.46,15.75 arc(21.28,15.3) 20.83,15.11 ; v1(69.34,29.59) C6.2 70.09,26.8 U12.7 74.17,26.8 74.29,26.67 74.29,25.65 74.17,25.53 U12.8 ; Q4.2 64.7,38.03 arc(64.76,38.17) 64.9,38.23 68.71,38.23 ; v1(10.92,18.42) 10.68,18.65 C19.2 ; 73.28,38.23 77.72,38.23 arc(78.08,38.08) 78.23,37.72 78.23,37.06 arc(78.22,37.03) Q1.2 ; 73.28,38.23 68.71,38.23 ; 73.28,38.23 arc(73.55,38.12) 73.66,37.85 73.66,37.06 arc(73.67,37.03) Q2.2 ; H2.2 91.31,18.67 91.19,18.8 91.19,20.7 90.93,20.95 89.28,20.95 89.19,21.05 R12.2 90.5,22.56 90.81,22.86 90.81,24.77 90.93,24.89 v1(92.58,24.89) ; R13.1 v1(45.09,16.91) ; 68.71,38.23 arc(69.07,38.08) 69.22,37.72 69.22,37.04 arc(69.21,37.02) Q3.2 69.34,36.88 v1(69.34,31.62) ; v1(0.64,17.65) 0.64,52.7 0.76,52.83 1.91,52.83 1.91,54.23 2.16,54.48 5.21,54.48 5.28,54.56 R34.1 ; R15.1 41.04,11.19 v1(41.02,11.18) ; 69.41,20.26 v1(68.07,20.26)
  Bottom Layer w0.305: v1(83.31,20.91) v1(86.36,20.91)
  Bottom Layer w0.61: 64.13,20.45 64.32,20.26 v1(68.07,20.26) ; 64.13,20.45 64.13,18.54 64.03,18.43 v1(56.66,18.43) ; 64.13,20.45 64.13,29.08 64.64,29.59 v1(69.34,29.59) v1(69.34,31.62) 80.65,31.62 80.9,31.37 80.9,21.34 81.28,20.95 83.27,20.95 v1(83.31,20.91) ; v1(92.58,24.89) 92.58,28.58 ; H1.5 95.63,34.67 95.25,34.29 v1(95.25,28.83) ; v1(69.85,10.79) 65.41,10.79 65.15,11.05 v1(65.15,12.06) ; 44.58,11.18 45.09,11.68 v1(45.09,16.91) ; 44.58,11.18 v1(41.02,11.18) ; 44.58,11.18 58.29,11.18 58.67,11.56 58.67,12.18 v1(58.66,12.19) 58.66,15.49 58.55,15.49 58.42,15.62 v1(56.51,15.62) ; v1(0.64,17.65) 10.67,17.65 10.92,17.91 v1(10.92,18.42) ; v1(54.99,20.07) 54.99,26.92 55.12,27.05 55.88,27.05 ; v1(21.21,24) v1(21.21,26.29) ; v1(73.41,13.72) 73.41,16 73.15,16.26 v1(72.39,16.26)
  vias: v1(18.42,14.48) v1(18.42,13.59) v1(19.42,14.48) v1(19.42,13.59) v1(20.32,14.48) v1(20.32,13.58) v1(37.97,13.72) v1(37.97,12.83) v1(37.97,11.68) v1(39.26,13.72) v1(39.27,12.83) v1(39.29,11.69)
GND: length 66.8
  Top Layer w0.254: U10.47 v1(47.79,26.8) ; U10.23 52.29,21.37 52.07,21.59 v1(51.44,21.59) ; U11.19 81.65,22.21 v1(81.79,22.35) ; U10.35 v1(53.09,26.51) ; U10.8 v1(46.99,23.51)
  Top Layer w0.305: U3.2 12.06,24.63 v1(12.83,23.86)
  Top Layer w0.61: C29.1 41.53,34.15 v1(41.53,37.34) ; v1(67.18,16.51) 68.56,16.51 68.61,16.55 ; C27.1 26.91,18.92 24.62,18.92 ; v1(29.84,21.84) 29.73,21.73 C24.1 ; 24.62,18.92 v1(22.99,18.92) ; 24.62,18.92 C25.1 ; C4.1 69.2,22.48 v1(67.94,22.48) ; C19.1 9.38,16.51 v1(8,16.51) ; C10.2 72.13,13.72 v1(72.14,13.72) ; v1(73.28,24.26) 69.47,24.26 69.34,24.38 C6.1 ; C22.1 41.02,16.78 v1(39.33,16.78) C26.1 ; C31.1 58.66,16.9 ; 58.66,16.9 C30.2 ; 58.66,16.9 59.93,16.9 v1(59.94,16.89) ; v1(22.61,27.94) 22.61,28.58 22.86,28.83 24.62,28.83 ; R22.2 v1(47.88,33.64) ; C18.1 v1(13.95,18.78) 15.3,18.78 C17.1 ; C2.2 89.73,25.91 v1(91.31,25.91) ; U6.2 U6.7 ; USB1.A1 6.77,27.87 USB1.1 ; v1(33.78,21.59) 33.78,21.59 v1(33.78,23.57) 33.84,23.51 35.23,23.51 U5.2 ; USB1.4 2.94,19.2 R10.1 ; 19.07,28.83 v1(17.4,28.83) ; USB1.2 7.42,20.2 USB1.A12 ; v1(82.04,29.34) U12.4
  Bottom Layer w0.254: v1(46.99,23.51) 45,23.51 ; v1(53.09,26.51) 54.36,26.51
  vias: v1(11.94,24.77) v1(11.95,23.88) v1(11.94,23.11) v1(12.83,24.77) v1(12.83,23.11) v1(13.67,24.77) v1(13.69,23.88) v1(13.69,23.11) v1(33.27,18.03) v1(33.78,24.32) v1(34.18,18.03)
VBAT: length 33.6
  Top Layer w0.61: U13.3 9.85,36.72 8.81,35.69 C13.1 v1(4.06,35.69) ; U15.3 7.37,11.62 ; U15.1 7.37,13.52 ; v1(4.06,27.18) 4.06,22.99 4.19,22.86 v1(5.33,22.86) ; 6.48,13.97 6.48,18.29 6.35,18.42 5.59,18.42 5.21,18.8 5.21,21.08 5.33,21.21 v1(5.33,21.34)
  Bottom Layer w0.61: v1(4.06,27.18) v1(4.06,35.69) ; v1(5.33,21.34) v1(5.33,22.86)
VBUS: length 37.4
  Top Layer w0.508: 7.42,21.47 8.26,21.47 8.53,21.74 8.54,21.73 8.54,21.71 ; 7.4,26.27 8.41,26.27 v1(8.54,26.39) 8.59,26.45 8.59,33.66 v1(7.87,33.66)
  Top Layer w0.61: 7.11,38.86 7.24,38.73 7.24,38.32 ; 7.11,38.86 6.58,38.86 ; 7.11,38.86 7.78,38.86 ; 11.91,21.88 11.56,21.88 11.56,21.52 11.5,21.46 ; 7.24,38.32 7.24,38.2 ; 7.24,38.32 arc(7.4,38.7) 7.78,38.86 ; v1(10.54,21.46) 11.5,21.46 ; 11.5,21.46 11.93,21.46 ; C14.1 5.69,38.86 6.58,38.86 ; 7.24,38.2 7.11,38.07 v1(7.11,36.96) 7.34,36.72 U13.4 ; 7.24,38.2 arc(7.04,38.67) 6.58,38.86 ; 7.78,38.86 13.46,38.86 13.59,38.74 R19.1
  Bottom Layer w0.508: v1(7.87,33.66) 7.87,36.7 7.75,36.83 7.24,36.83 v1(7.11,36.96)
  Bottom Layer w0.61: v1(8.54,26.39) 8.51,26.36 8.51,21.72 8.76,21.46 v1(10.54,21.46)
  vias: v1(8.53,21.71)
+VS: length 31.4
  Top Layer w0.61: 26.51,23.88 26.67,23.72 26.67,23.19 ; 26.51,23.88 25.94,23.88 ; 26.51,23.88 27.37,23.88 ; 25.94,23.88 Q5.3 ; 25.94,23.88 arc(26.46,23.67) 26.67,23.15 ; 29.84,20.19 33.17,20.19 ; 29.84,20.19 26.92,20.19 26.67,20.45 26.67,23.15 ; 29.84,20.19 29.59,19.94 R28.1 ; 33.17,20.19 33.53,20.19 ; 33.17,20.19 arc(33.59,20.02) 33.76,19.6 ; 27.37,23.88 28.43,23.88 28.81,23.5 32.31,23.5 U5.5 ; 27.37,23.88 arc(26.87,23.68) 26.67,23.19 ; 34.36,20.19 37.21,20.19 37.47,19.94 C26.2 ; 34.36,20.19 33.53,20.19 ; 34.36,20.19 arc(33.94,20.02) 33.76,19.6 ; 26.67,23.15 26.67,23.19 ; 33.53,20.19 33.76,19.96 33.76,19.6 ; 33.76,19.6 U6.5
AM_BUSY: length 32.1
  Top Layer w0.254: U11.11 79.76,17.02 76.58,17.02 v1(76.45,17.14) ; v1(76.45,23.62) 76.34,23.51 U10.29
  Bottom Layer w0.254: v1(76.45,17.14) v1(76.45,23.62)
AM_CLK: length 24.7
  Top Layer w0.254: U10.26 53.25,22.01 53.09,21.84 53.09,21.21 53.34,20.95 64.9,20.95 65.2,20.65 65.2,17.91 65.44,17.66 U11.9
AM_CS: length 21.5
  Top Layer w0.254: U10.25 65.49,21.51 65.66,21.34 65.66,18.54 65.91,18.29 72.75,18.29 U11.8
AM_DAT: length 22.3
  Top Layer w0.254: U10.28 67.16,23.01 67.3,22.87 67.3,19.32 67.69,18.92 72.74,18.92 U11.7
AM_RST: length 56.6
  Top Layer w0.254: U10.27 66.14,22.51 66.42,22.22 v1(66.42,19.3) ; C2.1 87.19,25.37 R12.1 87.14,22.61 85.72,22.61 85.6,22.48 85.6,19.05 85.51,18.96 U11.14 79.72,18.92 75.31,18.92 75.06,18.67 v1(75.06,16.13)
  Bottom Layer w0.254: v1(75.06,16.13) 75.06,12.06 74.93,11.94 66.68,11.94 66.42,12.19 v1(66.42,19.3)
COM1: length 29.4
  Top Layer w0.254: U10.30 68.08,24.01 68.28,24.21 68.28,30.17 68.38,30.28 76.12,30.28 76.33,30.48 R24.1
COM2: length 24.3
  Top Layer w0.254: R25.1 71.75,31.55 71.75,30.86 71.63,30.73 67.94,30.73 67.82,30.61 67.82,24.77 67.56,24.51 U10.31
COM3: length 19.6
  Top Layer w0.254: R26.1 67.31,31.6 67.31,25.15 67.17,25.01 U10.32
COM4: length 14.6
  Top Layer w0.254: U10.33 62.72,25.51 62.87,25.65 R27.1
I2C_SCL: length 47.6
  Top Layer w0.254: v1(31.24,22.61) 32.37,22.61 ; v1(32.89,28.83) 32.89,27.94 32.79,27.84 29.34,27.84 29.08,27.58 v1(29.08,26.94) R30.1 27.56,27.43 27.43,27.56 U16.6 ; v1(31.24,19.18) 32.89,19.18 U6.6 ; v1(43.31,33.27) 44.02,33.27 44.53,32.77 44.53,30.53 44.7,30.35 48.51,30.35 48.79,30.08 U10.45
  Bottom Layer w0.254: v1(31.24,19.18) v1(31.24,22.61) 29.21,22.61 29.08,22.73 v1(29.08,26.94) ; v1(43.31,33.27) 33.27,33.27 32.89,32.89 v1(32.89,28.83)
I2C_SDA: length 61.7
  Top Layer w0.254: U10.46 48.29,29.69 48.13,29.84 44.22,29.84 44.07,30 44.07,32.26 43.94,32.39 v1(42.8,32.39) ; 35.23,22.56 35.48,22.56 35.69,22.35 v1(35.69,21.08) 35.49,20.88 30.73,20.88 v1(30.48,21.14) ; v1(35.69,19.18) 35.69,16.13 35.56,16 34.67,16 34.56,16.11 U6.3 ; 22.83,26.29 22.83,26.29 v1(22.86,26.29) U16.5 25.91,26.29 26.16,26.03 30.23,26.03 30.48,26.29 R29.1 33.16,26.94 33.66,27.43 v1(33.66,28.32)
  Bottom Layer w0.254: v1(22.86,26.29) 22.86,23.65 22.86,23.65 22.86,21.41 23.14,21.14 v1(30.48,21.14) ; v1(33.66,28.32) 33.66,32.13 33.91,32.39 v1(42.8,32.39) ; v1(35.69,19.18) v1(35.69,21.08)
KEY1: length 51
  Top Layer w0.254: U10.10 44.35,22.51 44.2,22.35 44.2,20.67 44.37,20.5 45.72,20.5 45.82,20.4 45.82,15.6 45.59,15.37 30.48,15.37 30.23,15.11 30.23,13.73 C8.1
  Top Layer w0.457: SW1.2 24.54,9.05 24.77,9.27 24.77,13.72 ; 24.77,13.72 R14.2 ; 24.77,13.72 C8.1 30.24,9.64 30.73,9.14 34.34,9.14 SW1.1
KEY2: length 35.5
  Top Layer w0.254: 46.46,13.61 46.48,13.59 ; 46.46,13.61 46.3,13.77 ; 46.46,13.61 arc(46.51,13.59) 46.57,13.59 ; 46.46,13.61 arc(46.36,13.67) 46.3,13.77 ; 46.48,13.59 45.99,13.59 ; 46.48,13.59 46.57,13.59 ; 46.57,13.59 C9.1 ; R15.2 45.99,13.59 ; 45.99,13.59 arc(46.19,13.67) 46.28,13.88 ; 46.28,13.88 46.28,20.78 46.1,20.95 44.83,20.95 44.7,21.08 44.7,21.84 44.87,22.01 U10.11 ; 46.28,13.88 46.28,13.79 46.3,13.77 ; 46.28,13.88 arc(46.28,13.82) 46.3,13.77
  Top Layer w0.457: R15.2 43.04,9.38 42.67,9.02 38.91,9.02 SW2.2 ; SW2.1 53.84,9.02 49.91,9.02 49.55,9.38 C9.1
KEY3: length 63.5
  Top Layer w0.254: 67.87,11.18 53.97,11.18 53.65,11.51 53.65,14.55 53.47,14.73 46.86,14.73 46.74,14.86 46.74,21.34 46.56,21.51 U10.12 ; R16.2 68.57,13.74 C10.1 68.58,13.72 68.58,11.43 68.33,11.18 68.12,11.18
  Top Layer w0.457: 68.6,9.13 69.11,9.13 ; 68.6,9.13 68.59,9.14 68.59,9.65 ; 68.6,9.13 68.07,9.13 ; 69.11,9.13 SW3.1 ; 69.11,9.13 arc(68.74,9.28) 68.59,9.65 ; 68.07,11.18 68.12,11.18 arc(68.45,11.04) 68.59,10.71 ; 68.07,11.18 67.87,11.18 ; 68.07,11.18 arc(68.43,11.33) 68.58,11.69 ; C10.1 68.59,10.71 ; 68.59,10.71 68.59,9.65 ; 68.59,9.65 arc(68.44,9.28) 68.07,9.13 ; 68.07,9.13 SW3.2
KEY4: length 75.7
  Top Layer w0.254: U10.13 47.29,15.45 47.55,15.19 54.03,15.19 54.1,15.11 54.1,11.94 54.23,11.81 57.53,11.81 57.66,11.94 57.66,14.66 57.86,14.86 87.12,14.86 87.38,14.61 87.38,13.61 87.38,13.6
  Top Layer w0.457: SW4.1 92.2,9.02 87.76,9.02 87.38,9.39 87.38,13.6 ; 87.38,13.6 R17.2 81.91,13.58 81.91,9.4 81.57,9.05 SW4.2 ; 87.38,13.6 C11.1
LED1: length 9.5
  Top Layer w0.254: LED2.1 48.43,15.86 48.29,16 U10.15
LED2: length 10.1
  Top Layer w0.254: LED2.2 53.7,17.68 53.59,17.79 53.21,17.79 53.09,17.66 53.09,16.51 52.9,16.32 48.96,16.32 48.77,16.51 48.77,19.99 U10.16
LED3: length 10.6
  Top Layer w0.254: LED2.4 54.5,18.14 54.36,18.29 52.71,18.29 52.58,18.16 52.58,16.89 52.46,16.78 49.39,16.78 49.28,16.89 49.28,20 U10.17
PWR_EN: length 56.6
  Top Layer w0.254: R31.2 18.81,23.75 v1(20.19,23.75) ; U10.38 52.29,22.57 v1(52.2,22.48)
  Bottom Layer w0.254: v1(20.19,23.75) 20.19,28.58 20.57,28.96 31.37,28.96 31.62,28.7 31.62,23.37 32.11,22.88 37.99,22.88 38.24,22.62 38.24,19.67 38.74,19.18 52.07,19.18 52.2,19.3 v1(52.2,22.48)
RES_PHOTO: length 76.2
  Top Layer w0.254: 7.73,52.45 7.73,56.5 7.87,56.64 R34.2 ; v1(47.12,25.91) 47.62,25.91 47.79,25.75 U10.14 ; v1(32.64,33.95) 31.99,33.95 31.88,34.06 31.88,34.92 31.62,35.18 20.07,35.18 19.81,35.43 19.81,50.55 19.56,50.8 8.13,50.8 7.87,51.05 7.87,52.44 R35.1
  Bottom Layer w0.254: v1(32.64,33.95) 44.58,33.95 44.83,33.7 44.83,28.32 45.16,27.99 46.96,27.99 47.12,27.84 v1(47.12,25.91)
RXD: length 47.8
  Top Layer w0.254: U3.20 13.58,26.66 13.72,26.8 16.13,26.8 16.26,26.67 16.26,25.37 16.51,25.12 35.97,25.12 36.19,24.89 36.19,21.72 36.45,21.46 v1(37.59,21.46) ; U10.21 51.29,18.52 51.18,18.42 v1(50.55,18.42)
  Bottom Layer w0.254: v1(50.55,18.42) 37.85,18.42 37.59,18.67 v1(37.59,21.46)
SEGA: length 34.6
  Top Layer w0.254: U10.18 49.79,25.52 v1(49.28,26.03) ; v1(38.99,34.64) 32.64,34.64 32.38,34.9 32.38,36.32 32.24,36.47 R1.1
  Bottom Layer w0.254: v1(49.28,26.03) 49.28,28.19 49.02,28.45 45.72,28.45 45.34,28.83 45.34,34.27 44.97,34.64 v1(38.99,34.64)
SEGB: length 31.3
  Top Layer w0.254: U10.19 50.29,26.17 v1(50.04,26.42) ; v1(38.29,35.31) 35.07,35.31 34.67,35.7 34.67,36.45 R2.1
  Bottom Layer w0.254: v1(38.29,35.31) 45.73,35.31 45.95,35.09 45.92,33.84 45.92,33.83 45.92,29.13 46.1,28.96 49.66,28.96 49.91,28.7 49.91,26.54 v1(50.04,26.42)
SEGC: length 27.6
  Top Layer w0.254: v1(50.67,27.05) 50.67,26.92 50.79,26.81 U10.20 ; R3.1 39.04,36.32 v1(40.64,36.32)
  Bottom Layer w0.254: v1(40.64,36.32) 46.13,36.32 46.63,35.82 46.63,29.69 46.86,29.46 50.42,29.46 50.67,29.21 v1(50.67,27.05)
SEGD: length 15.7
  Top Layer w0.254: R4.1 59.94,34.54 59.69,34.29 52.2,34.29 51.79,33.88 U10.39
SEGDP: length 14.4
  Top Layer w0.254: U10.43 49.79,34.67 49.61,34.85 43.38,34.85 43.18,35.05 43.18,36.39 R8.1
SEGE: length 12.1
  Top Layer w0.254: R5.1 55.75,36.45 55.75,35.05 55.5,34.8 51.56,34.8 51.29,34.52 U10.40
SEGF: length 8.6
  Top Layer w0.254: R6.1 51.53,35.4 51.45,35.32 50.94,35.32 50.79,35.17 U10.41
SEGG: length 10.7
  Top Layer w0.254: U10.42 50.29,35.06 50.04,35.31 47.5,35.31 47.37,35.43 47.37,36.41 R7.1
SPI_CS_AM: length 31.2
  Top Layer w0.254: U11.3 77.7,21.56 77.85,21.72 77.85,25.27 78.1,25.53 U12.1 85.47,25.53 85.6,25.4 v1(85.6,24) ; H1.1 98.04,24 v1(91.69,24)
  Bottom Layer w0.254: v1(91.69,24) v1(85.6,24)
SPI_MISO: length 29.7
  Top Layer w0.254: H1.2 98.3,26.8 U12.2 77.34,26.8 77.22,26.67 77.22,22.99 77.09,22.86 U11.1
SPI_MOSI: length 39.5
  Top Layer w0.254: v1(70.99,29.34) U12.5 77.47,29.34 77.72,29.59 77.72,31.88 77.98,32.13 H1.4 ; v1(70.65,22.21) 70.65,22.21 U11.2
  Bottom Layer w0.254: v1(70.65,22.21) 70.65,28.99 v1(70.99,29.34)
SPI_SCK: length 38
  Top Layer w0.254: H1.3 97.92,30.23 78.49,30.23 78.23,29.97 78.23,28.19 78.1,28.07 U12.6 v1(71.34,28.07) ; v1(71.34,21.07) 71.34,20.95 71.37,20.91 U11.4
  Bottom Layer w0.254: v1(71.34,28.07) v1(71.34,21.07)
TXD: length 51.2
  Top Layer w0.254: v1(36.86,22.23) 36.65,22.44 36.65,25.32 36.4,25.58 16.89,25.58 16.76,25.7 16.76,27.05 16.51,27.31 13.21,27.31 13.08,27.17 U3.21 ; v1(50.04,17.65) 51.53,17.65 51.79,17.91 U10.22
  Bottom Layer w0.254: v1(50.04,17.65) 37.21,17.65 36.86,18.01 v1(36.86,22.23)
USB_DN: length 9.2
  Top Layer w0.254: 10.81,23.63 8.19,23.63 8.19,23.62 USB1.A7 ; 7.41,23.62 5.08,23.62 4.95,23.75 4.95,24.51 5.06,24.62 USB1.B7
USB_DP: length 9.1
  Top Layer w0.254: v1(9.4,22.86) 9.27,22.86 9.02,23.11 7.42,23.11 USB1.B6 ; 9.4,24.13 10.81,24.13 ; 9.4,24.13 v1(9.4,25.27) ; 9.4,24.13 7.42,24.13 USB1.A6
  Bottom Layer w0.254: v1(9.4,22.86) v1(9.4,25.27)
$1N1449: length 34.7
  Top Layer w0.254: Q3.3 68.25,58.47 68,58.72 55.37,58.72 55.25,58.6 55.25,57.66 54.99,57.4 54.03,57.4 DS1.8
$1N1467: length 15.8
  Top Layer w0.254: DS1.1 43.56,42.29 43.56,41.02 44.07,40.51 55.63,40.51 55.74,40.4 R5.2
$1N1471: length 17.6
  Top Layer w0.254: DS1.2 46.1,42.29 46.1,41.53 46.35,41.28 59.82,41.28 59.94,41.15 R4.2
$1N1475: length 16.8
  Top Layer w0.254: R8.2 43.11,40.26 41.53,40.26 41.28,40.51 41.28,44.07 41.66,44.45 48.39,44.45 48.64,44.2 48.64,42.47 DS1.3
$1N1479: length 20.7
  Top Layer w0.254: R3.2 38.9,44.11 39.75,44.96 50.8,44.96 51.31,44.45 51.31,42.42 DS1.4
$1N1483: length 10.3
  Top Layer w0.254: R7.2 v1(49.39,38.47)
  Bottom Layer w0.254: v1(49.39,38.47) 53.58,38.47 53.85,38.73 53.85,42.34 DS1.5
$1N1487: length 34.5
  Top Layer w0.254: DS1.11 46.23,57.58 46.23,56.13 45.97,55.88 30.86,55.88 30.48,55.5 R1.2
$1N1491: length 40.1
  Top Layer w0.254: R2.2 34.69,54.75 35.31,55.37 55.75,55.37 56.26,55.88 56.26,57.53 DS1.7
$1N1495: length 21.5
  Top Layer w0.254: v1(50.04,39.75) 51.44,39.75 51.53,39.66 R6.2
  Bottom Layer w0.254: v1(50.04,39.75) 49.84,39.95 49.84,53.34 49.58,53.59 48.9,53.59 48.77,53.72 48.77,57.58 DS1.10
$1N6161: length 8.8
  Top Layer w0.254: U11.12 85.97,17.66 86.11,17.53 86.11,16.51 86.23,16.38 87.26,16.38 C1.1
$1N6192: length 8.5
  Top Layer w0.254: R11.1 87.16,19.56 86.23,19.56 86.11,19.43 86.11,18.54 85.88,18.31 U11.13
$1N6375: length 29.3
  Top Layer w0.254: v1(83.06,32.89) 83.06,47.45 SPK1.1 ; U11.18 82.8,21.56 83.06,21.82 v1(83.06,24.77)
  Bottom Layer w0.254: v1(83.06,24.77) v1(83.06,32.89)
$1N6384: length 39.3
  Top Layer w0.254: v1(84.46,32.89) 84.46,45.97 84.84,46.36 91.61,46.36 SPK1.2 ; U11.16 84.15,20.26 84.46,20.57 v1(84.46,24.77)
  Bottom Layer w0.254: v1(84.46,24.77) v1(84.46,32.89)
$1N6917: length 7.9
  Top Layer w0.254: U12.3 86.23,28.07 86.36,28.19 86.36,28.45 86.49,28.58 C7.2
$1N7212: length 6.1
  Top Layer w0.254: R13.2 43.74,19.08 43.74,22.75 43.99,23.01 U10.9
$1N7925: length 7.8
  Top Layer w0.254: U10.3 42.7,26.01 42.54,26.16 42.54,26.67 42.42,26.8 41.04,26.8 C20.2 40.93,26.9 X1.1
$1N7930: length 8
  Top Layer w0.254: X1.2 40.8,24.4 C21.2 41.04,24.64 42.42,24.64 42.54,24.77 42.54,25.4 42.65,25.51 U10.4
$1N8028: length 6.2
  Top Layer w0.254: 46.23,31.64 46.09,31.5 49.02,31.5 49.29,31.23 U10.44
$1N8104: length 4.2
  Top Layer w0.254: R23.1 55.37,13.72 55.25,13.84 55.25,15.75 55.13,15.86 LED2.3
$1N8256: length 54.1
  Top Layer w0.254: Q1.3 v1(77.25,53.21)
  Bottom Layer w0.254: v1(77.25,53.21) 50.8,53.21 50.55,53.47 50.55,56.01 50.04,56.52 50.04,58.8 49.66,59.18 43.81,59.18 43.56,58.93 43.56,57.71 DS1.12
$1N8335: length 42.4
  Top Layer w0.254: DS1.9 51.31,57.66 51.31,59.06 51.56,59.31 72.14,59.31 72.75,58.7 Q2.3
$1N8343: length 10.2
  Top Layer w0.254: Q4.3 63.75,42.17 63.5,42.42 56.39,42.42 DS1.6
$1N8477: length 3.4
  Top Layer w0.254: R24.2 76.33,36.99 Q1.1
$1N8481: length 3.4
  Top Layer w0.254: 71.8,37.02 71.84,36.98 R25.2
$1N8485: length 3.7
  Top Layer w0.254: R26.2 67.35,37.17 67.3,37.11 Q3.1
$1N8489: length 3.4
  Top Layer w0.254: Q4.1 62.87,36.95 R27.2
$1N8598: length 9.5
  Top Layer w0.254: U10.7 43.69,24.01 43.18,23.5 43.18,20.19 43.05,20.07 41.15,20.07 41.02,19.94 41.02,19.03 C22.2
$1N9384: length 2.1
  Top Layer w0.254: 32.19,16.83 U6.1 ; 32.19,16.83 31.88,16.83 ; 32.19,16.83 arc(31.97,16.73) 31.88,16.51 ; 32.19,16.83 arc(31.97,16.92) 31.88,17.14
$1N9794: length 65.6
  Top Layer w0.254: U10.37 52.79,32.26 53.17,32.64 65.41,32.64 65.53,32.77 v1(65.53,35.05) ; R32.1 91.95,22.59 91.95,20.83 92.07,20.7 v1(94.11,20.7)
  Bottom Layer w0.254: v1(94.11,20.7) 94.11,34.54 93.6,35.05 v1(65.53,35.05)
$1N9795: length 5.8
  Top Layer w0.254: H2.1 98.55,22.22 98.17,22.61 R32.2
$1N9824: length 50.4
  Top Layer w0.254: U10.34 60.32,26.01 60.61,26.29 v1(60.71,26.29) ; v1(60.71,20.07) 60.71,15.49 60.83,15.37 91.82,15.37 92.09,15.1 R33.1
  Bottom Layer w0.254: v1(60.71,26.29) v1(60.71,20.07)
$1N9825: length 4.5
  Top Layer w0.254: R33.2 H2.4
$1N10132: length 20.3
  Top Layer w1.219: 1.91,47.75 1.91,42.42 2.67,41.65 BT1.1
$1N10135: length 66.6
  Top Layer w0.254: v1(27.18,32.51) 19.81,32.51 19.3,33.02 19.3,49.91 18.92,50.29 1.91,50.29 ; v1(32.13,30.23) 32.51,30.6 42.55,30.6 43.05,30.1 43.05,27.31 43.35,27.01 U10.1
  Bottom Layer w0.254: v1(27.18,32.51) 27.18,30.48 27.43,30.23 v1(32.13,30.23)
$1N18652: length 3.8
  Top Layer w0.61: Q5.1 22.39,21.73 R31.1
$2N394: length 7.4
  Top Layer w0.254: USB1.A5 5.1,25.12 4.83,25.4 4.83,30.05 R9.2
$2N397: length 8
  Top Layer w0.254: R10.2 4.57,17.26 4.57,21.72 4.98,22.12 USB1.B5
$2N1836: length 9.3
  Top Layer w0.254: U3.9 12.58,20.82 12.7,20.7 18.67,20.7 18.8,20.57 R21.1
$2N6842: length 5.4
  Top Layer w0.254: U13.5 7.24,34.92 7.11,34.8 7.11,33.02 6.98,32.89 4.93,32.89 R18.1
$2N6856: length 6.1
  Top Layer w0.254: U13.1 13.35,34.92 ; 13.35,34.92 13.35,32.13 LED5.2 ; 13.35,34.92 LED4.1
$2N6873: length 3.1
  Top Layer w0.254: 15.59,38.05 15.64,38 LED4.2
$2N6876: length 3.1
  Top Layer w0.254: R20.2 15.71,31.93 15.74,31.95

## Copper pours and planes (outline as drawn; the poured copper is in the pictures)
+3V3 on Top Layer: 37.1,14.48 41.83,14.48 41.83,10.61 37.1,10.61
+3V3 on Top Layer: 8.51,23.27 23.74,23.27 23.74,12.57 8.51,12.57
+3V3 on Bottom Layer: 17.02,15.11 39.88,15.11 39.88,10.61 17.02,10.61
GND on Top Layer: -22.86,72.64 110.36,72.64 110.36,-9.4 -22.86,-9.4
GND on Bottom Layer: -11.3,68.2 107.06,68.2 107.06,-6.1 -11.3,-6.1
VBAT on Top Layer: 4.06,15.24 8.51,15.24 8.51,2.16 4.06,2.16
$1N9384 on Top Layer: 23.73,17.65 32,17.65 32,15.73 23.73,15.73

Small or netless copper shapes (teardrops, artwork), in the pictures only: 2 on Top Layer, 1 on Bottom Layer
